# EAGLE schematic 16REG_2a (EAGLE 6.5.0)

## Sheet 1 of 19
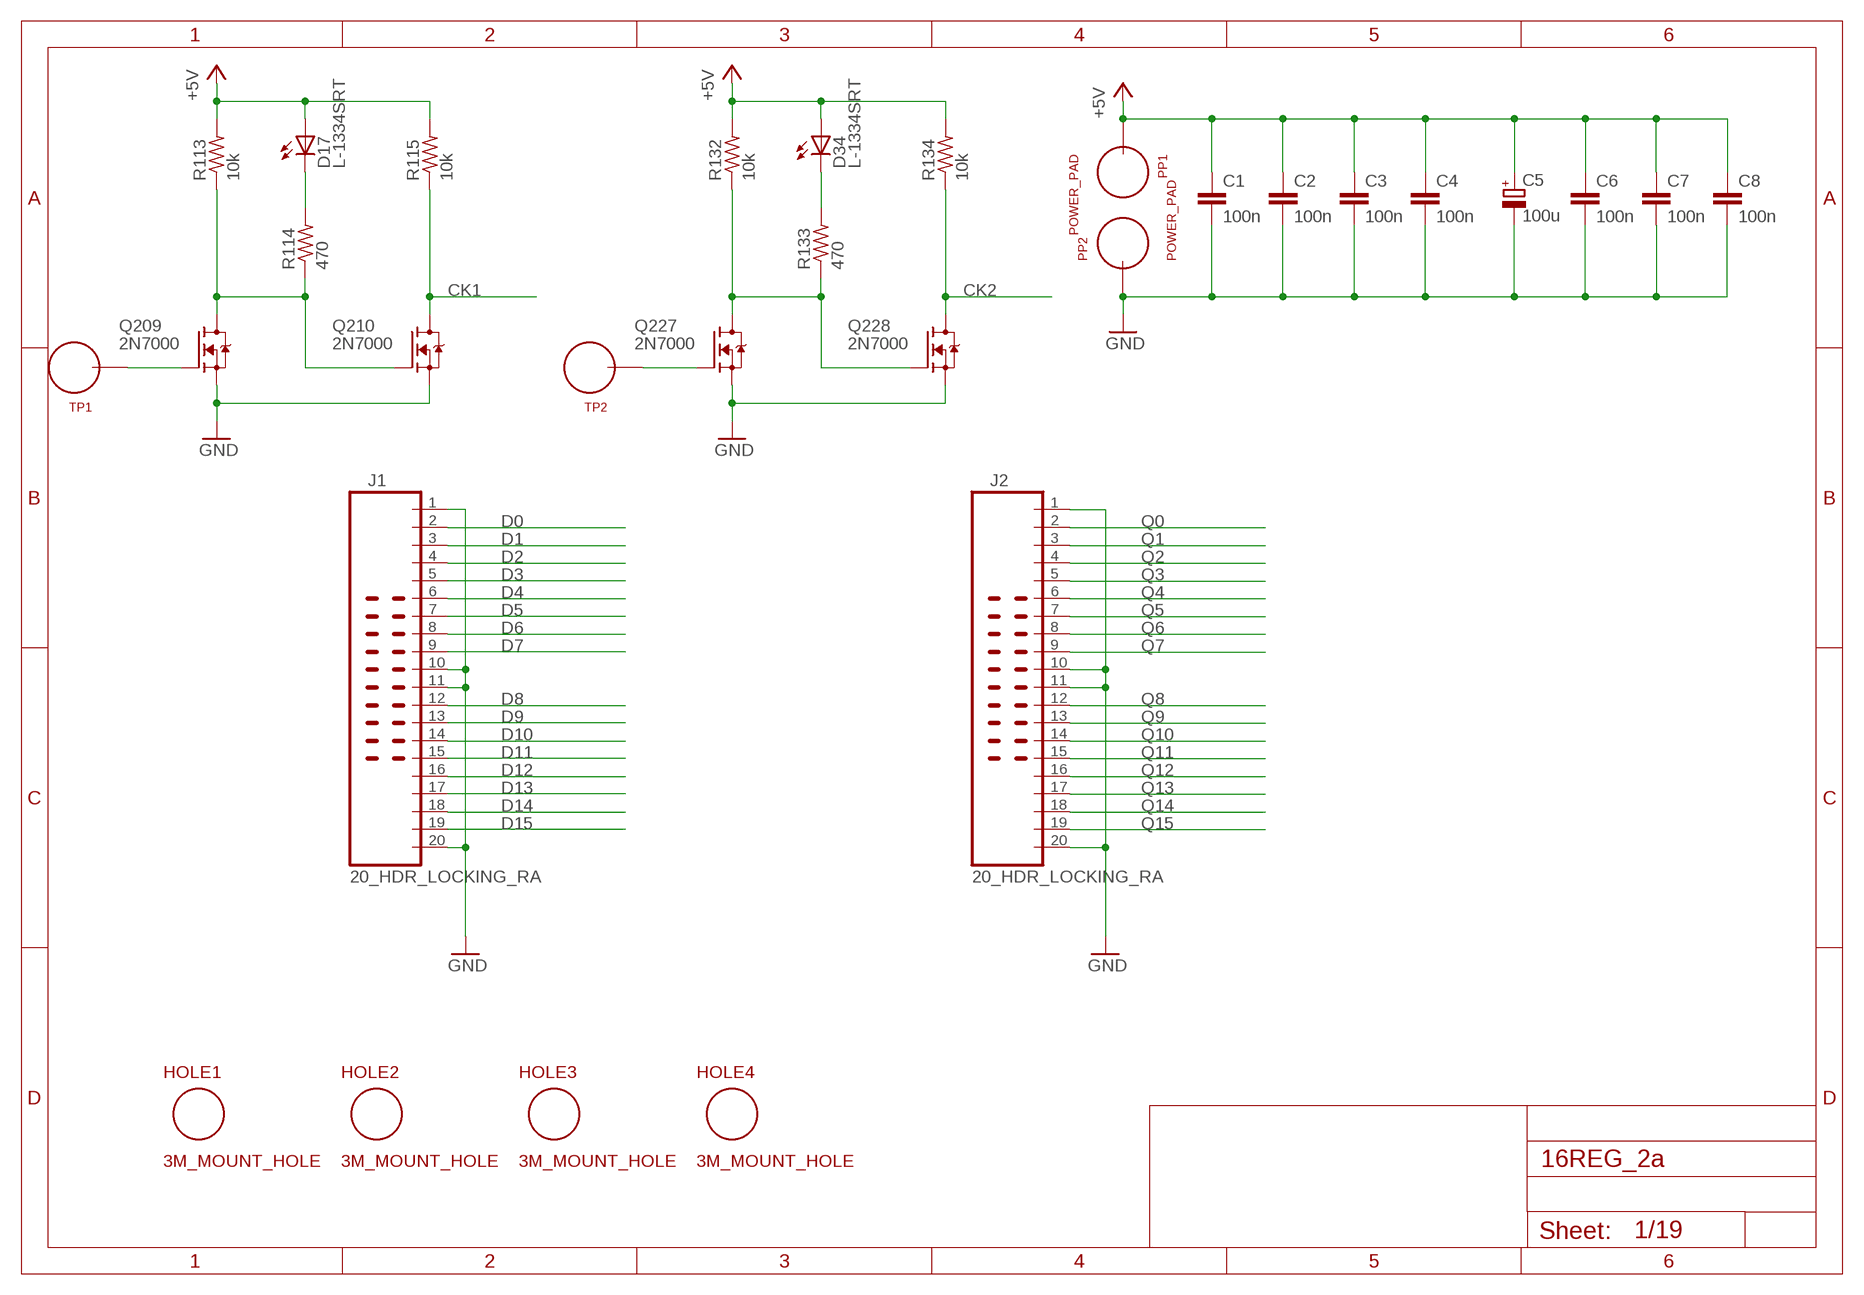
[diagram p0: schematic, sheet 1]

### Parts
C1  100n  C_P2INCH  [CAP_P2INCH]
C2  100n  C_P2INCH  [CAP_P2INCH]
C3  100n  C_P2INCH  [CAP_P2INCH]
C4  100n  C_P2INCH  [CAP_P2INCH]
C5  100u  POLARISED_CAP_2P5  [POLARISED_CAP_2P5]
C6  100n  C_P2INCH  [CAP_P2INCH]
C7  100n  C_P2INCH  [CAP_P2INCH]
C8  100n  C_P2INCH  [CAP_P2INCH]
D17  L-1334SRT  [LED3MM]
D34  L-1334SRT  [LED3MM]
HOLE1  3M_MOUNT_HOLE  [3M_HOLE]
HOLE2  3M_MOUNT_HOLE  [3M_HOLE]
HOLE3  3M_MOUNT_HOLE  [3M_HOLE]
HOLE4  3M_MOUNT_HOLE  [3M_HOLE]
J1  20_HDR_LOCKING_RA  [20_HDR_LOCKING_RA]
J2  20_HDR_LOCKING_RA  [20_HDR_LOCKING_RA]
PP1  POWER_PAD  [POWER_PAD]
PP2  POWER_PAD  [POWER_PAD]
Q209  2N7000  [TO92-DGS]
Q210  2N7000  [TO92-DGS]
Q227  2N7000  [TO92-DGS]
Q228  2N7000  [TO92-DGS]
R113  10k  R_P2INCH  [R_P2INCH]
R114  470  R_P2INCH  [R_P2INCH]
R115  10k  R_P2INCH  [R_P2INCH]
R132  10k  R_P2INCH  [R_P2INCH]
R133  470  R_P2INCH  [R_P2INCH]
R134  10k  R_P2INCH  [R_P2INCH]
TP1  TEST_LOOP  [TEST_LOOP]
TP2  TEST_LOOP  [TEST_LOOP]

### Nets
+5V: C1.1 C2.1 C3.1 C4.1 C5.A C6.1 C7.1 C8.1 D17.A D34.A PP1.1 R113.2 R115.2 R132.2 R134.2 ; also sheet 3,4,5,6,7,8,9,10,11,12,13,14,15,16,17,18,19
CK1: Q210.D R115.1 ; also sheet 4,5,6,7,8,9,10,11,12,13,14,15,16,17,18,19
CK2: Q228.D R134.1 ; also sheet 4,5,6,7,8,9,10,11,12,13,14,15,16,17,18,19
D0: J1.2 ; also sheet 3,4
D1: J1.3 ; also sheet 3,5
D2: J1.4 ; also sheet 3,6
D3: J1.5 ; also sheet 3,7
D4: J1.6 ; also sheet 3,8
D5: J1.7 ; also sheet 3,9
D6: J1.8 ; also sheet 3,10
D7: J1.9 ; also sheet 3,11
D8: J1.12 ; also sheet 3,12
D9: J1.13 ; also sheet 3,13
D10: J1.14 ; also sheet 3,14
D11: J1.15 ; also sheet 3,15
D12: J1.16 ; also sheet 3,16
D13: J1.17 ; also sheet 3,17
D14: J1.18 ; also sheet 3,18
D15: J1.19 ; also sheet 3,19
GND: C1.2 C2.2 C3.2 C4.2 C5.K C6.2 C7.2 C8.2 J1.1 J1.10 J1.11 J1.20 J2.1 J2.10 J2.11 J2.20 PP2.1 Q209.S Q210.S Q227.S Q228.S ; also sheet 2,3,4,5,6,7,8,9,10,11,12,13,14,15,16,17,18,19
N$1: Q227.G TP2.P$1
N$2: Q227.D Q228.G R132.1 R133.1
N$3: D34.K(C) R133.2
N$8: D17.K(C) R114.2
N$201: Q209.G TP1.P$1
N$202: Q209.D Q210.G R113.1 R114.1
Q0: J2.2 ; also sheet 2,4
Q1: J2.3 ; also sheet 2,5
Q2: J2.4 ; also sheet 2,6
Q3: J2.5 ; also sheet 2,7
Q4: J2.6 ; also sheet 2,8
Q5: J2.7 ; also sheet 2,9
Q6: J2.8 ; also sheet 2,10
Q7: J2.9 ; also sheet 2,11
Q8: J2.12 ; also sheet 2,12
Q9: J2.13 ; also sheet 2,13
Q10: J2.14 ; also sheet 2,14
Q11: J2.15 ; also sheet 2,15
Q12: J2.16 ; also sheet 2,16
Q13: J2.17 ; also sheet 2,17
Q14: J2.18 ; also sheet 2,18
Q15: J2.19 ; also sheet 2,19

## Sheet 2 of 19
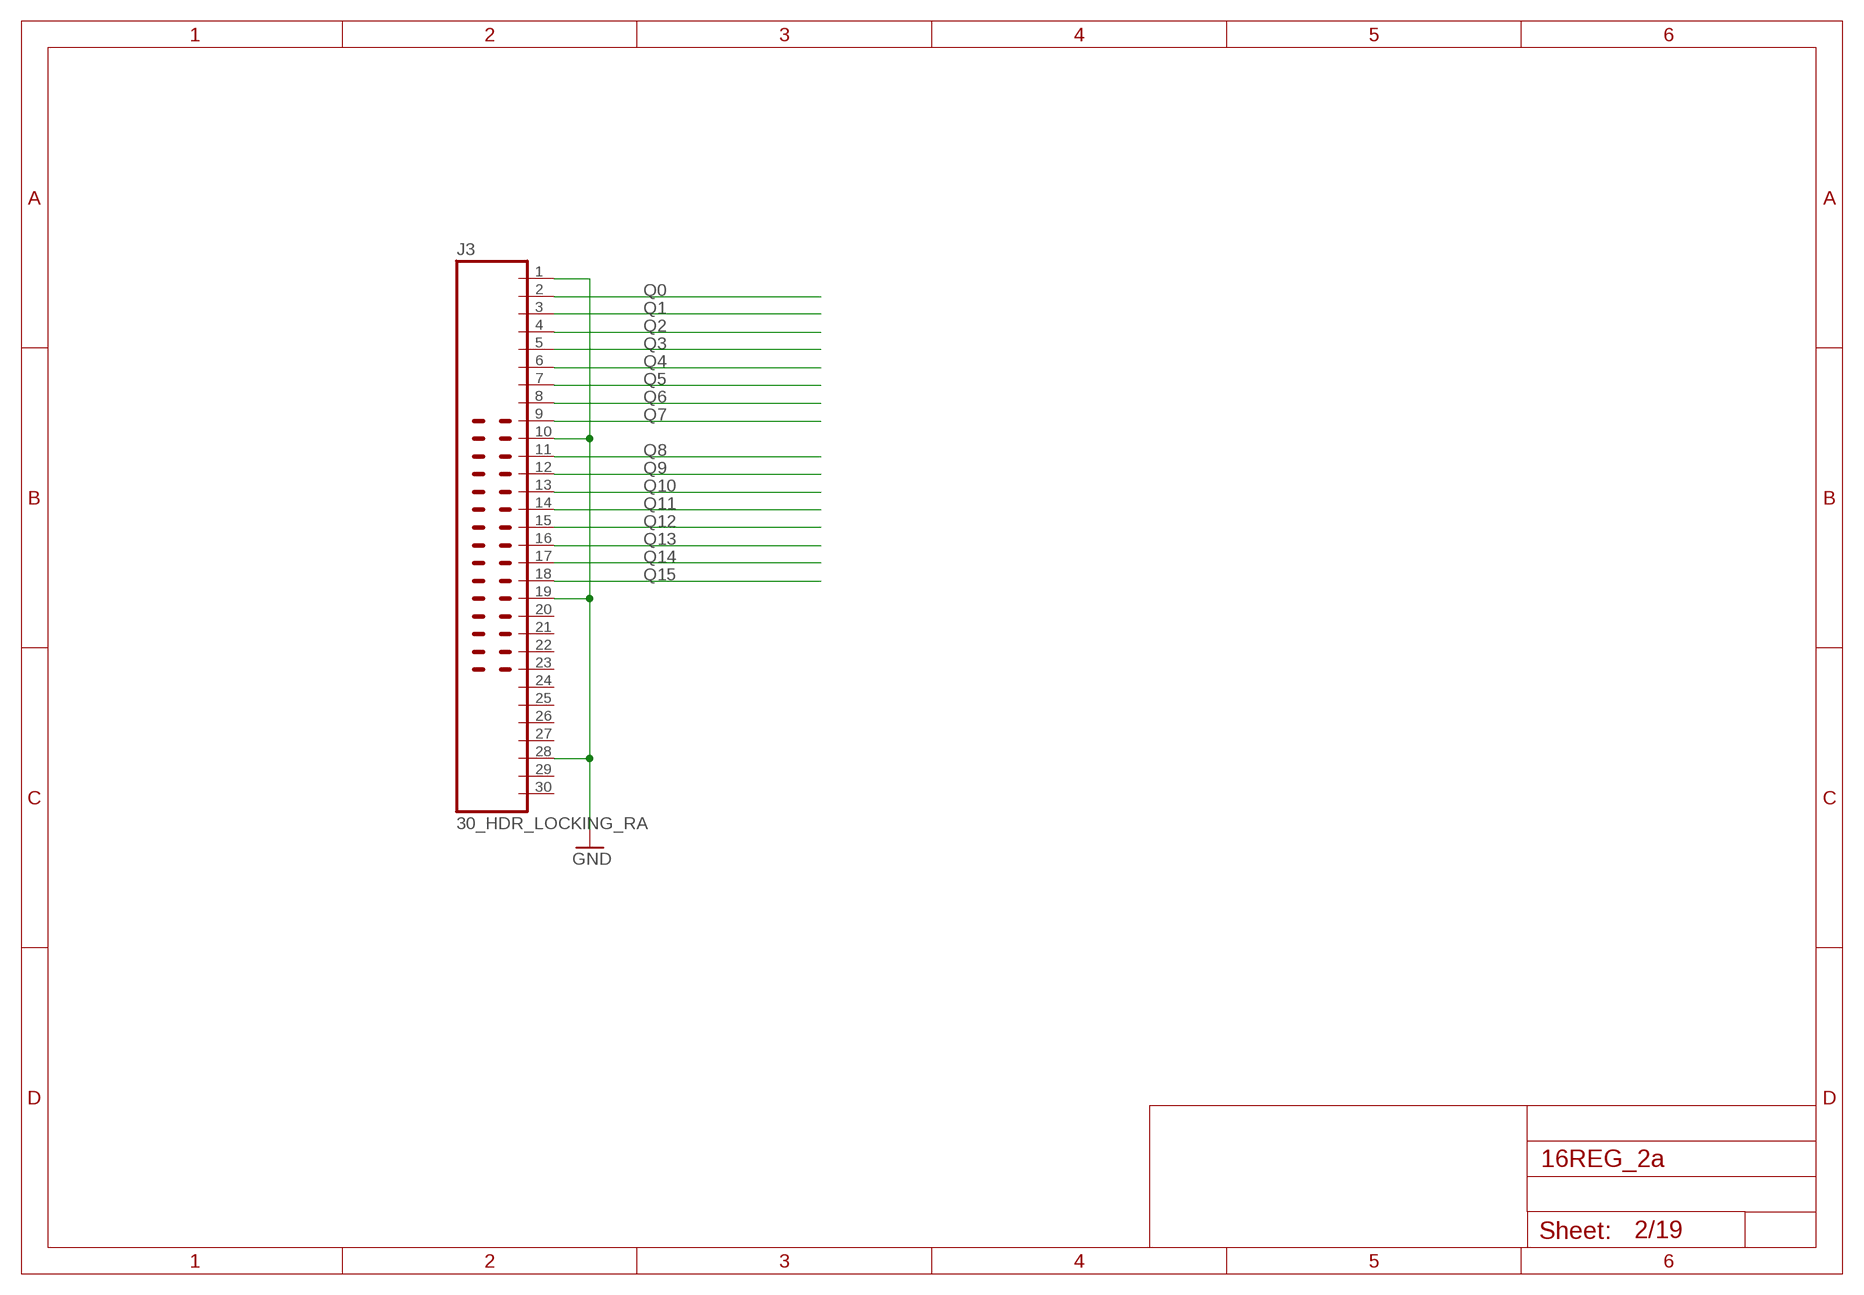
[diagram p1: schematic, sheet 2]

### Parts
J3  30_HDR_LOCKING_RA  [30_HDR_LOCKING_RA]

### Nets
GND: J3.1 J3.10 J3.19 J3.28 ; also sheet 1,3,4,5,6,7,8,9,10,11,12,13,14,15,16,17,18,19
Q0: J3.2 ; also sheet 1,4
Q1: J3.3 ; also sheet 1,5
Q2: J3.4 ; also sheet 1,6
Q3: J3.5 ; also sheet 1,7
Q4: J3.6 ; also sheet 1,8
Q5: J3.7 ; also sheet 1,9
Q6: J3.8 ; also sheet 1,10
Q7: J3.9 ; also sheet 1,11
Q8: J3.11 ; also sheet 1,12
Q9: J3.12 ; also sheet 1,13
Q10: J3.13 ; also sheet 1,14
Q11: J3.14 ; also sheet 1,15
Q12: J3.15 ; also sheet 1,16
Q13: J3.16 ; also sheet 1,17
Q14: J3.17 ; also sheet 1,18
Q15: J3.18 ; also sheet 1,19
Unconnected: J3.20 J3.21 J3.22 J3.23 J3.24 J3.25 J3.26 J3.27 J3.29 J3.30

## Sheet 3 of 19
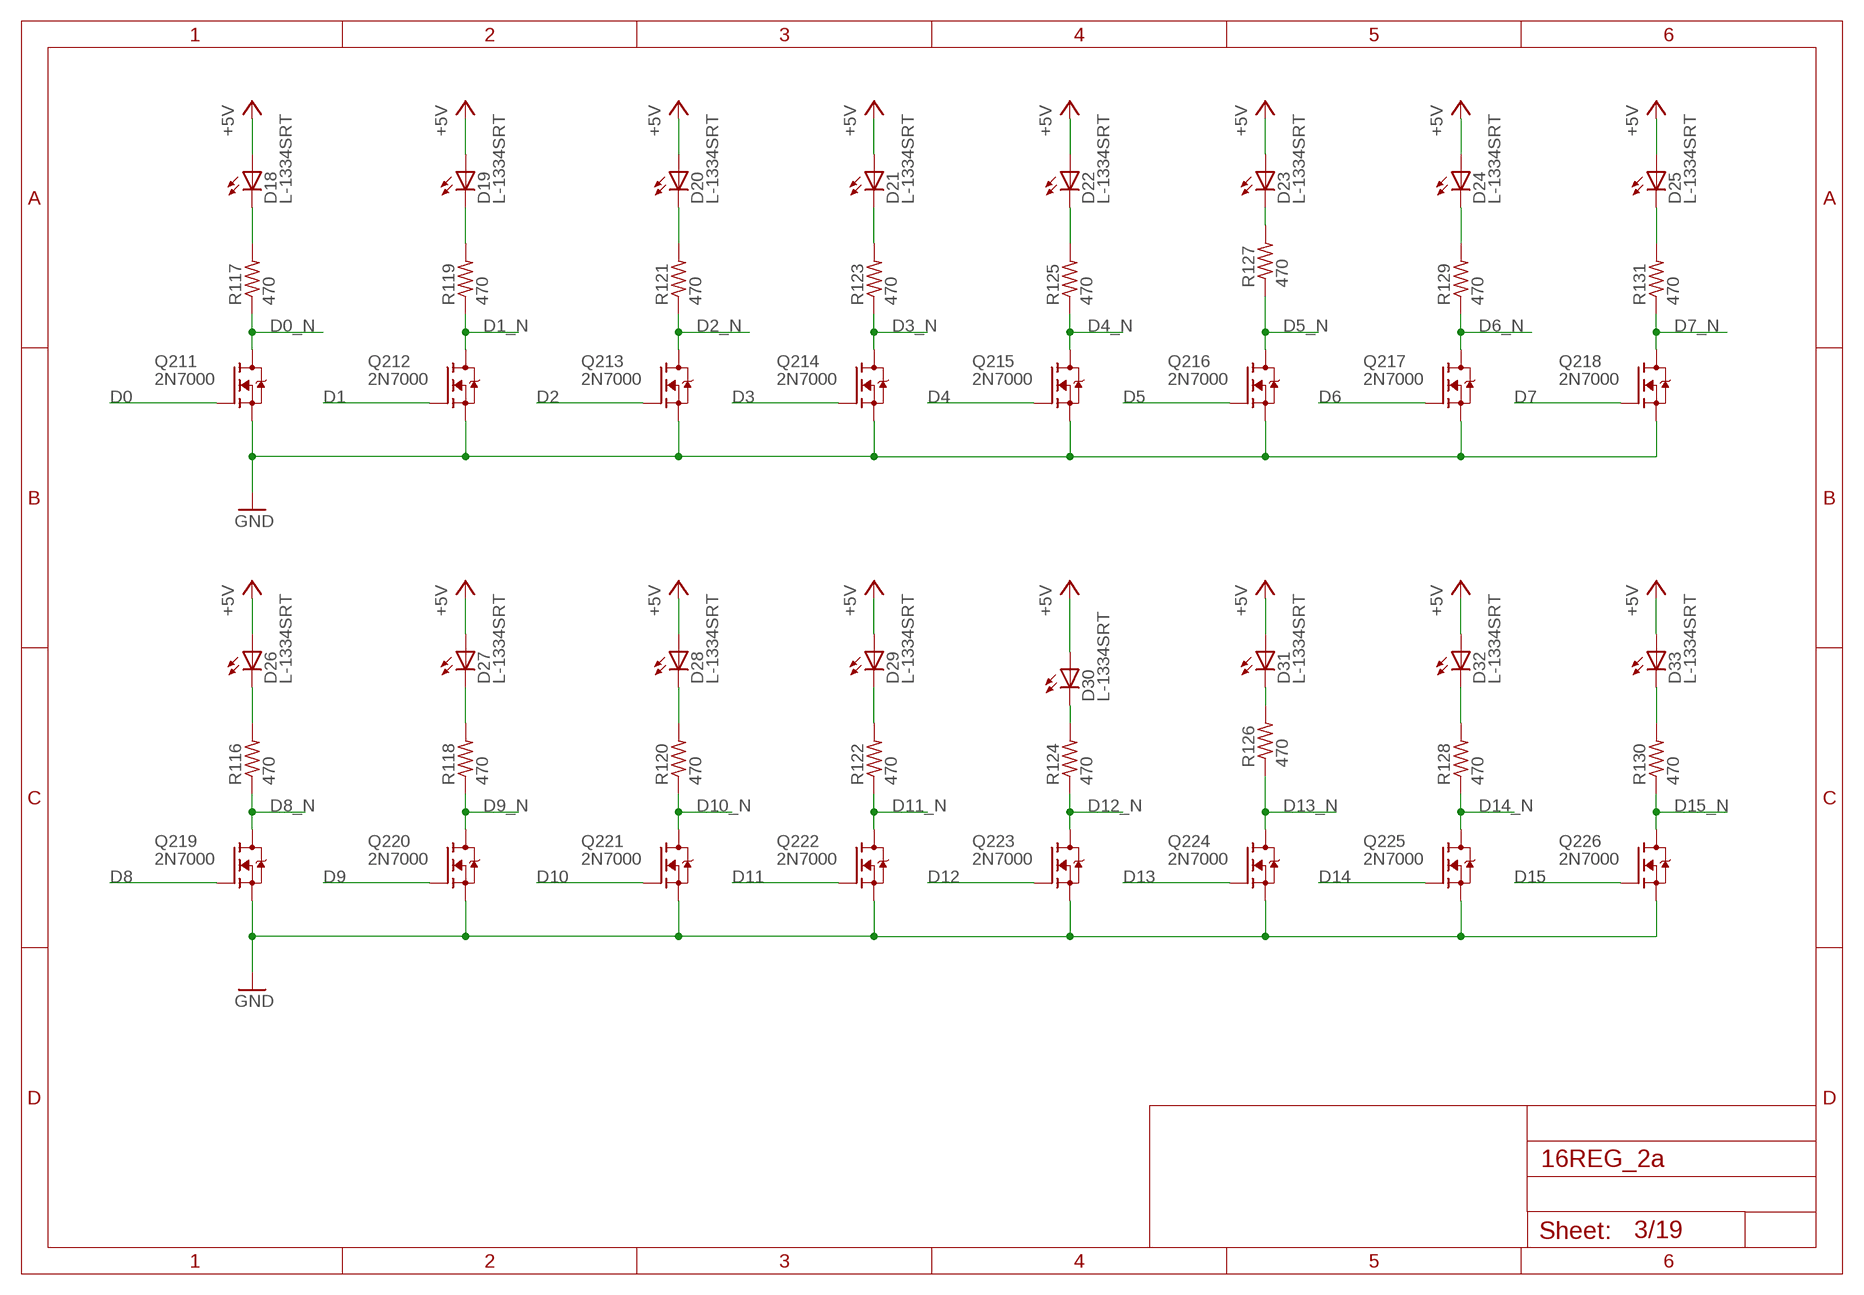
[diagram p2: schematic, sheet 3]

### Parts
D18  L-1334SRT  [LED3MM]
D19  L-1334SRT  [LED3MM]
D20  L-1334SRT  [LED3MM]
D21  L-1334SRT  [LED3MM]
D22  L-1334SRT  [LED3MM]
D23  L-1334SRT  [LED3MM]
D24  L-1334SRT  [LED3MM]
D25  L-1334SRT  [LED3MM]
D26  L-1334SRT  [LED3MM]
D27  L-1334SRT  [LED3MM]
D28  L-1334SRT  [LED3MM]
D29  L-1334SRT  [LED3MM]
D30  L-1334SRT  [LED3MM]
D31  L-1334SRT  [LED3MM]
D32  L-1334SRT  [LED3MM]
D33  L-1334SRT  [LED3MM]
Q211  2N7000  [TO92-DGS]
Q212  2N7000  [TO92-DGS]
Q213  2N7000  [TO92-DGS]
Q214  2N7000  [TO92-DGS]
Q215  2N7000  [TO92-DGS]
Q216  2N7000  [TO92-DGS]
Q217  2N7000  [TO92-DGS]
Q218  2N7000  [TO92-DGS]
Q219  2N7000  [TO92-DGS]
Q220  2N7000  [TO92-DGS]
Q221  2N7000  [TO92-DGS]
Q222  2N7000  [TO92-DGS]
Q223  2N7000  [TO92-DGS]
Q224  2N7000  [TO92-DGS]
Q225  2N7000  [TO92-DGS]
Q226  2N7000  [TO92-DGS]
R116  470  R_P2INCH  [R_P2INCH]
R117  470  R_P2INCH  [R_P2INCH]
R118  470  R_P2INCH  [R_P2INCH]
R119  470  R_P2INCH  [R_P2INCH]
R120  470  R_P2INCH  [R_P2INCH]
R121  470  R_P2INCH  [R_P2INCH]
R122  470  R_P2INCH  [R_P2INCH]
R123  470  R_P2INCH  [R_P2INCH]
R124  470  R_P2INCH  [R_P2INCH]
R125  470  R_P2INCH  [R_P2INCH]
R126  470  R_P2INCH  [R_P2INCH]
R127  470  R_P2INCH  [R_P2INCH]
R128  470  R_P2INCH  [R_P2INCH]
R129  470  R_P2INCH  [R_P2INCH]
R130  470  R_P2INCH  [R_P2INCH]
R131  470  R_P2INCH  [R_P2INCH]

### Nets
+5V: D18.A D19.A D20.A D21.A D22.A D23.A D24.A D25.A D26.A D27.A D28.A D29.A D30.A D31.A D32.A D33.A ; also sheet 1,4,5,6,7,8,9,10,11,12,13,14,15,16,17,18,19
D0: Q211.G ; also sheet 1,4
D0_N: Q211.D R117.1
D1: Q212.G ; also sheet 1,5
D1_N: Q212.D R119.1
D2: Q213.G ; also sheet 1,6
D2_N: Q213.D R121.1
D3: Q214.G ; also sheet 1,7
D3_N: Q214.D R123.1
D4: Q215.G ; also sheet 1,8
D4_N: Q215.D R125.1
D5: Q216.G ; also sheet 1,9
D5_N: Q216.D R127.1
D6: Q217.G ; also sheet 1,10
D6_N: Q217.D R129.1
D7: Q218.G ; also sheet 1,11
D7_N: Q218.D R131.1
D8: Q219.G ; also sheet 1,12
D8_N: Q219.D R116.1
D9: Q220.G ; also sheet 1,13
D9_N: Q220.D R118.1
D10: Q221.G ; also sheet 1,14
D10_N: Q221.D R120.1
D11: Q222.G ; also sheet 1,15
D11_N: Q222.D R122.1
D12: Q223.G ; also sheet 1,16
D12_N: Q223.D R124.1
D13: Q224.G ; also sheet 1,17
D13_N: Q224.D R126.1
D14: Q225.G ; also sheet 1,18
D14_N: Q225.D R128.1
D15: Q226.G ; also sheet 1,19
D15_N: Q226.D R130.1
GND: Q211.S Q212.S Q213.S Q214.S Q215.S Q216.S Q217.S Q218.S Q219.S Q220.S Q221.S Q222.S Q223.S Q224.S Q225.S Q226.S ; also sheet 1,2,4,5,6,7,8,9,10,11,12,13,14,15,16,17,18,19
N$203: D18.K(C) R117.2
N$205: D19.K(C) R119.2
N$207: D20.K(C) R121.2
N$209: D21.K(C) R123.2
N$211: D22.K(C) R125.2
N$213: D23.K(C) R127.2
N$215: D24.K(C) R129.2
N$217: D25.K(C) R131.2
N$219: D33.K(C) R130.2
N$221: D32.K(C) R128.2
N$223: D31.K(C) R126.2
N$225: D30.K(C) R124.2
N$227: D29.K(C) R122.2
N$229: D28.K(C) R120.2
N$231: D27.K(C) R118.2
N$233: D26.K(C) R116.2

## Sheet 4 of 19
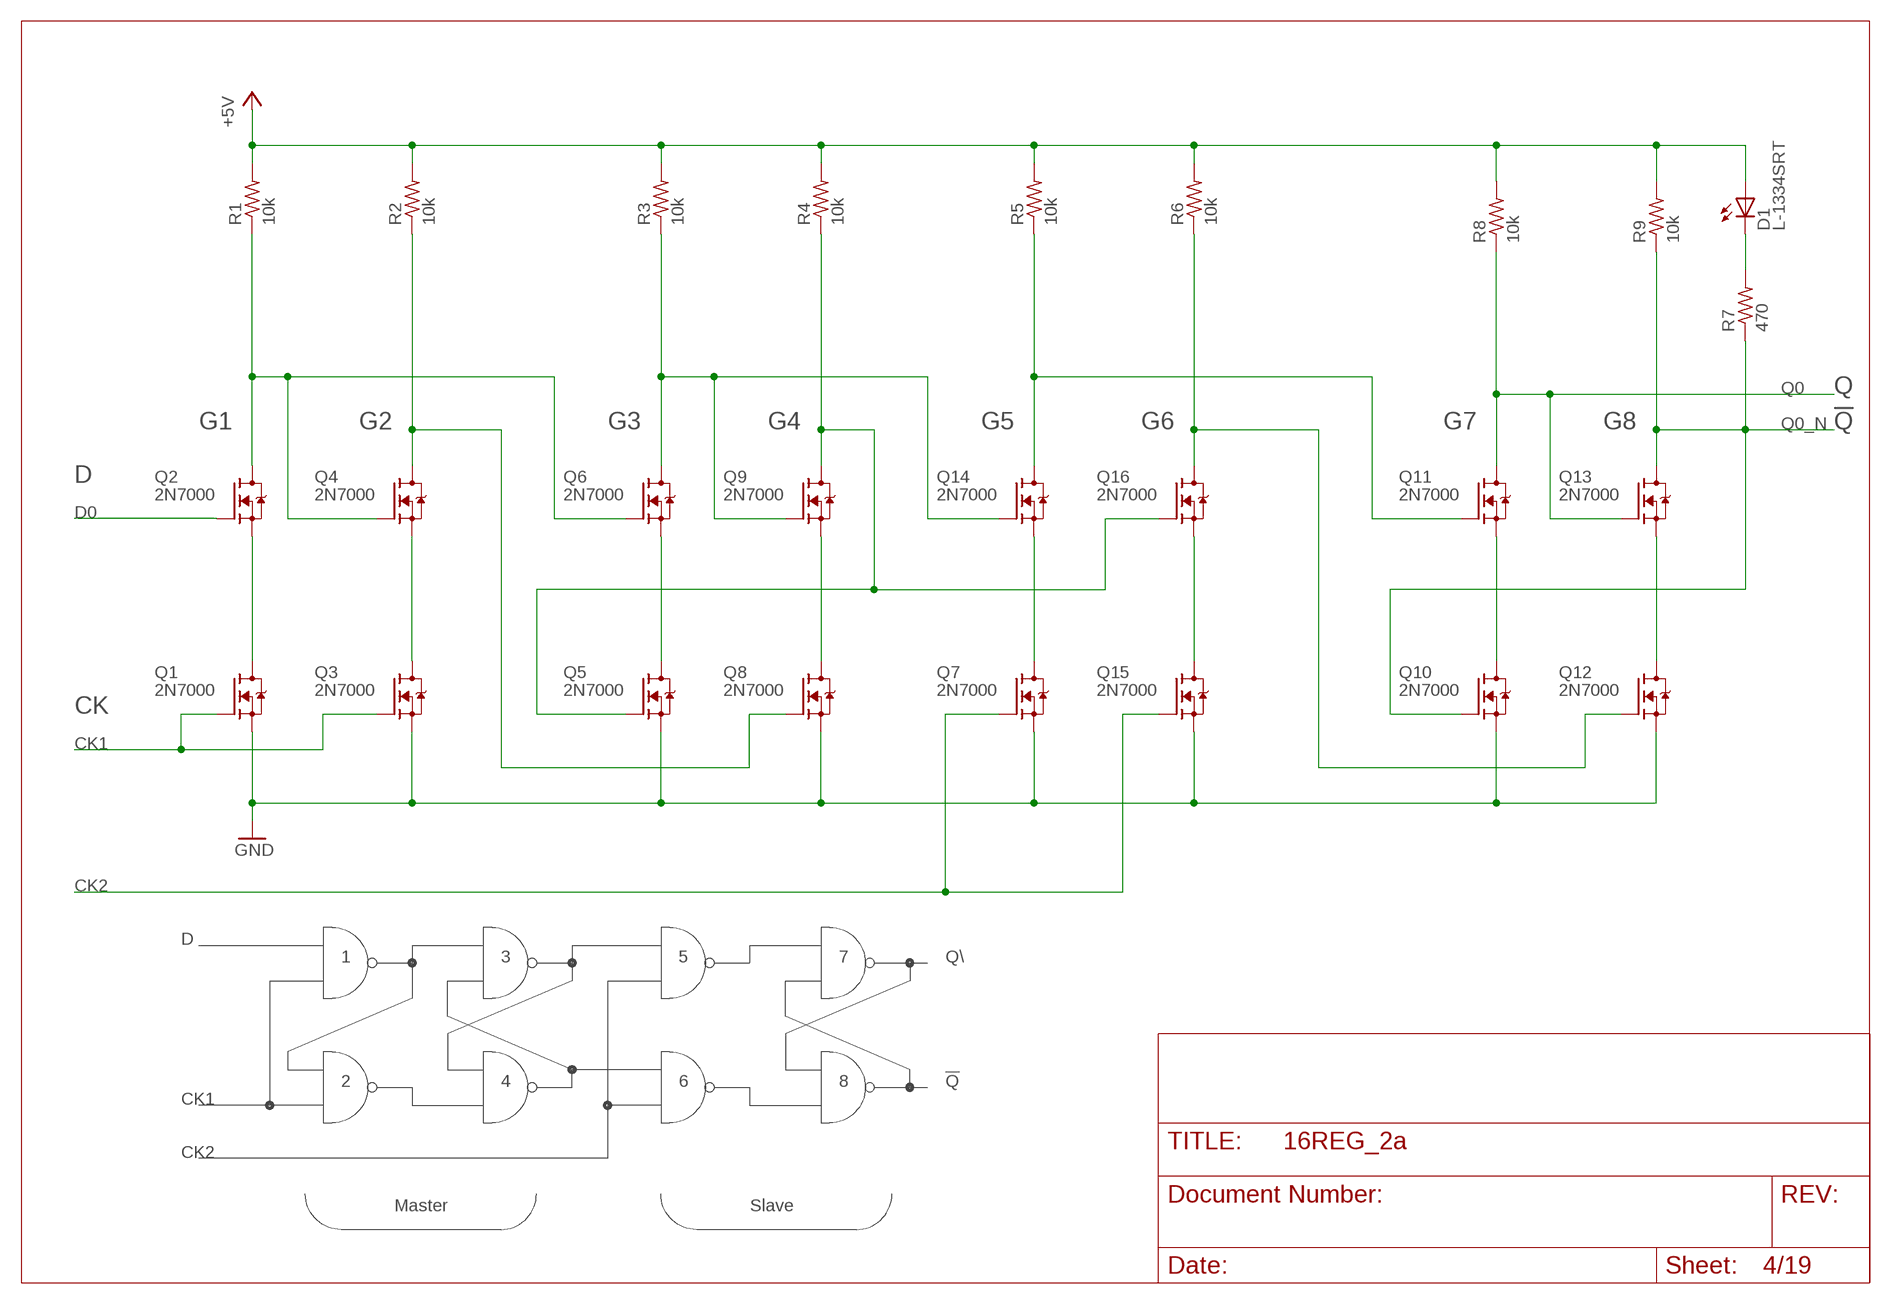
[diagram p3: schematic, sheet 4]

### Parts
D1  L-1334SRT  [LED3MM]
Q1  2N7000  [TO92-DGS]
Q2  2N7000  [TO92-DGS]
Q3  2N7000  [TO92-DGS]
Q4  2N7000  [TO92-DGS]
Q5  2N7000  [TO92-DGS]
Q6  2N7000  [TO92-DGS]
Q7  2N7000  [TO92-DGS]
Q8  2N7000  [TO92-DGS]
Q9  2N7000  [TO92-DGS]
Q10  2N7000  [TO92-DGS]
Q11  2N7000  [TO92-DGS]
Q12  2N7000  [TO92-DGS]
Q13  2N7000  [TO92-DGS]
Q14  2N7000  [TO92-DGS]
Q15  2N7000  [TO92-DGS]
Q16  2N7000  [TO92-DGS]
R1  10k  R_P2INCH  [R_P2INCH]
R2  10k  R_P2INCH  [R_P2INCH]
R3  10k  R_P2INCH  [R_P2INCH]
R4  10k  R_P2INCH  [R_P2INCH]
R5  10k  R_P2INCH  [R_P2INCH]
R6  10k  R_P2INCH  [R_P2INCH]
R7  470  R_P2INCH  [R_P2INCH]
R8  10k  R_P2INCH  [R_P2INCH]
R9  10k  R_P2INCH  [R_P2INCH]

### Nets
+5V: D1.A R1.2 R2.2 R3.2 R4.2 R5.2 R6.2 R8.2 R9.2 ; also sheet 1,3,5,6,7,8,9,10,11,12,13,14,15,16,17,18,19
CK1: Q1.G Q3.G ; also sheet 1,5,6,7,8,9,10,11,12,13,14,15,16,17,18,19
CK2: Q7.G Q15.G ; also sheet 1,5,6,7,8,9,10,11,12,13,14,15,16,17,18,19
D0: Q2.G ; also sheet 1,3
GND: Q1.S Q3.S Q5.S Q7.S Q8.S Q10.S Q12.S Q15.S ; also sheet 1,2,3,5,6,7,8,9,10,11,12,13,14,15,16,17,18,19
N$4: Q7.D Q14.S
N$5: Q6.D Q9.G Q14.G R3.1
N$6: Q15.D Q16.S
N$7: Q4.D Q8.G R2.1
N$9: Q1.D Q2.S
N$10: Q3.D Q4.S
N$11: Q11.G Q14.D R5.1
N$12: Q5.D Q6.S
N$13: Q8.D Q9.S
N$14: Q10.D Q11.S
N$15: Q12.D Q13.S
N$16: Q2.D Q4.G Q6.G R1.1
N$19: Q5.G Q9.D Q16.G R4.1
N$22: Q12.G Q16.D R6.1
N$25: D1.K(C) R7.2
Q0: Q11.D Q13.G R8.1 ; also sheet 1,2
Q0_N: Q10.G Q13.D R7.1 R9.1

### Notes on the sheet
- Q
- G1 | G2 | G3 | G4 | G5 | G6 | G7 | G8 | !Q
- D
- CK
- D
- 1 | 3 | 5 | 7 | Q\
- 2 | 4 | 6 | 8 | !Q
- CK1
- CK2
- Master | Slave

## Sheet 5 of 19
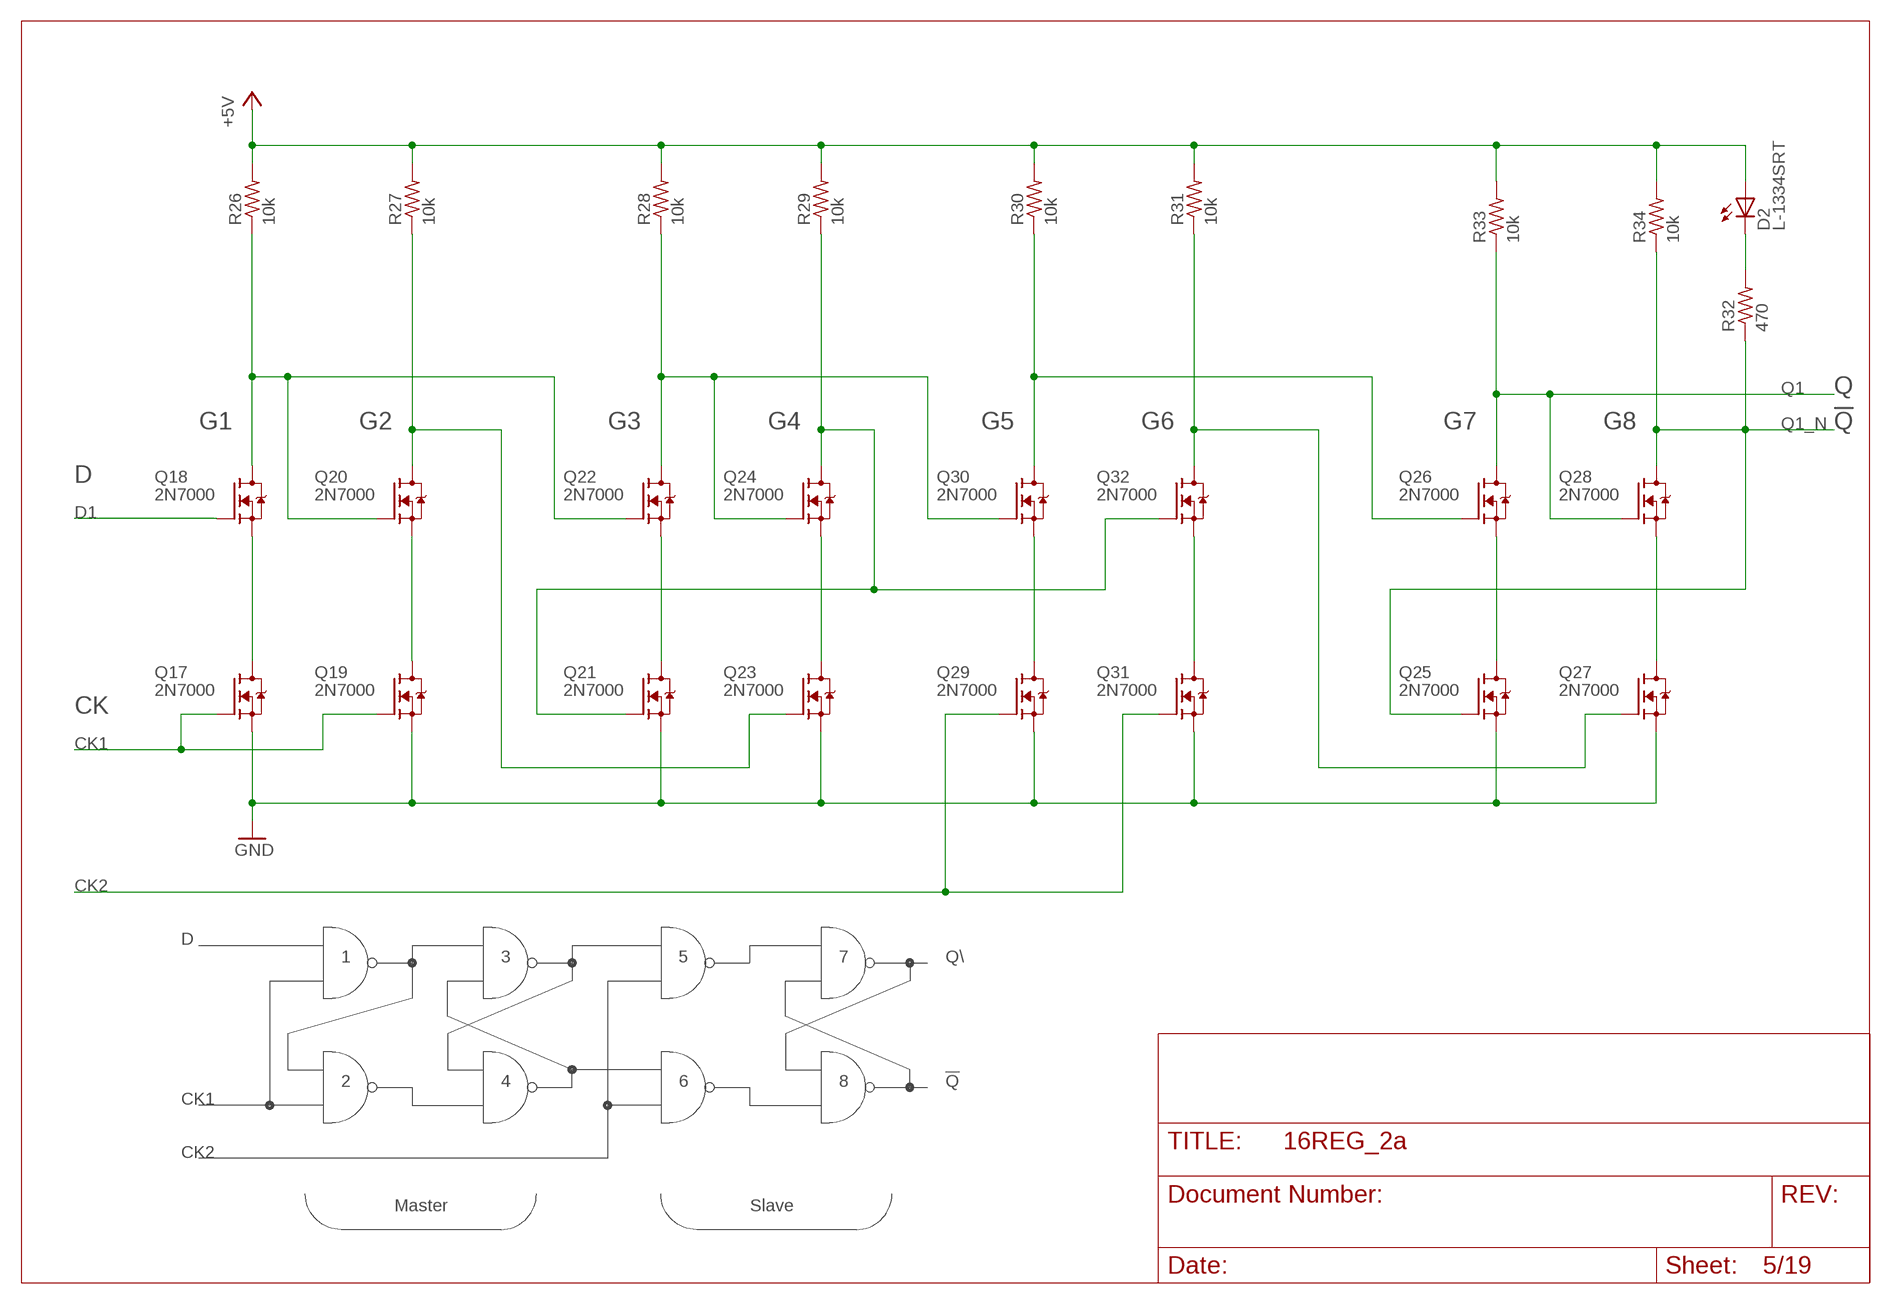
[diagram p4: schematic, sheet 5]

### Parts
D2  L-1334SRT  [LED3MM]
Q17  2N7000  [TO92-DGS]
Q18  2N7000  [TO92-DGS]
Q19  2N7000  [TO92-DGS]
Q20  2N7000  [TO92-DGS]
Q21  2N7000  [TO92-DGS]
Q22  2N7000  [TO92-DGS]
Q23  2N7000  [TO92-DGS]
Q24  2N7000  [TO92-DGS]
Q25  2N7000  [TO92-DGS]
Q26  2N7000  [TO92-DGS]
Q27  2N7000  [TO92-DGS]
Q28  2N7000  [TO92-DGS]
Q29  2N7000  [TO92-DGS]
Q30  2N7000  [TO92-DGS]
Q31  2N7000  [TO92-DGS]
Q32  2N7000  [TO92-DGS]
R26  10k  R_P2INCH  [R_P2INCH]
R27  10k  R_P2INCH  [R_P2INCH]
R28  10k  R_P2INCH  [R_P2INCH]
R29  10k  R_P2INCH  [R_P2INCH]
R30  10k  R_P2INCH  [R_P2INCH]
R31  10k  R_P2INCH  [R_P2INCH]
R32  470  R_P2INCH  [R_P2INCH]
R33  10k  R_P2INCH  [R_P2INCH]
R34  10k  R_P2INCH  [R_P2INCH]

### Nets
+5V: D2.A R26.2 R27.2 R28.2 R29.2 R30.2 R31.2 R33.2 R34.2 ; also sheet 1,3,4,6,7,8,9,10,11,12,13,14,15,16,17,18,19
CK1: Q17.G Q19.G ; also sheet 1,4,6,7,8,9,10,11,12,13,14,15,16,17,18,19
CK2: Q29.G Q31.G ; also sheet 1,4,6,7,8,9,10,11,12,13,14,15,16,17,18,19
D1: Q18.G ; also sheet 1,3
GND: Q17.S Q19.S Q21.S Q23.S Q25.S Q27.S Q29.S Q31.S ; also sheet 1,2,3,4,6,7,8,9,10,11,12,13,14,15,16,17,18,19
N$17: Q17.D Q18.S
N$18: Q19.D Q20.S
N$20: Q21.D Q22.S
N$21: Q23.D Q24.S
N$23: Q25.D Q26.S
N$24: Q27.D Q28.S
N$26: Q18.D Q20.G Q22.G R26.1
N$27: Q21.G Q24.D Q32.G R29.1
N$28: D2.K(C) R32.2
N$29: Q22.D Q24.G Q30.G R28.1
N$30: Q20.D Q23.G R27.1
N$31: Q29.D Q30.S
N$32: Q31.D Q32.S
N$33: Q26.G Q30.D R30.1
N$34: Q27.G Q32.D R31.1
Q1: Q26.D Q28.G R33.1 ; also sheet 1,2
Q1_N: Q25.G Q28.D R32.1 R34.1

### Notes on the sheet
- Q
- G1 | G2 | G3 | G4 | G5 | G6 | G7 | G8 | !Q
- D
- CK
- D
- 1 | 3 | 5 | 7 | Q\
- 2 | 4 | 6 | 8 | !Q
- CK1
- CK2
- Master | Slave

## Sheet 6 of 19
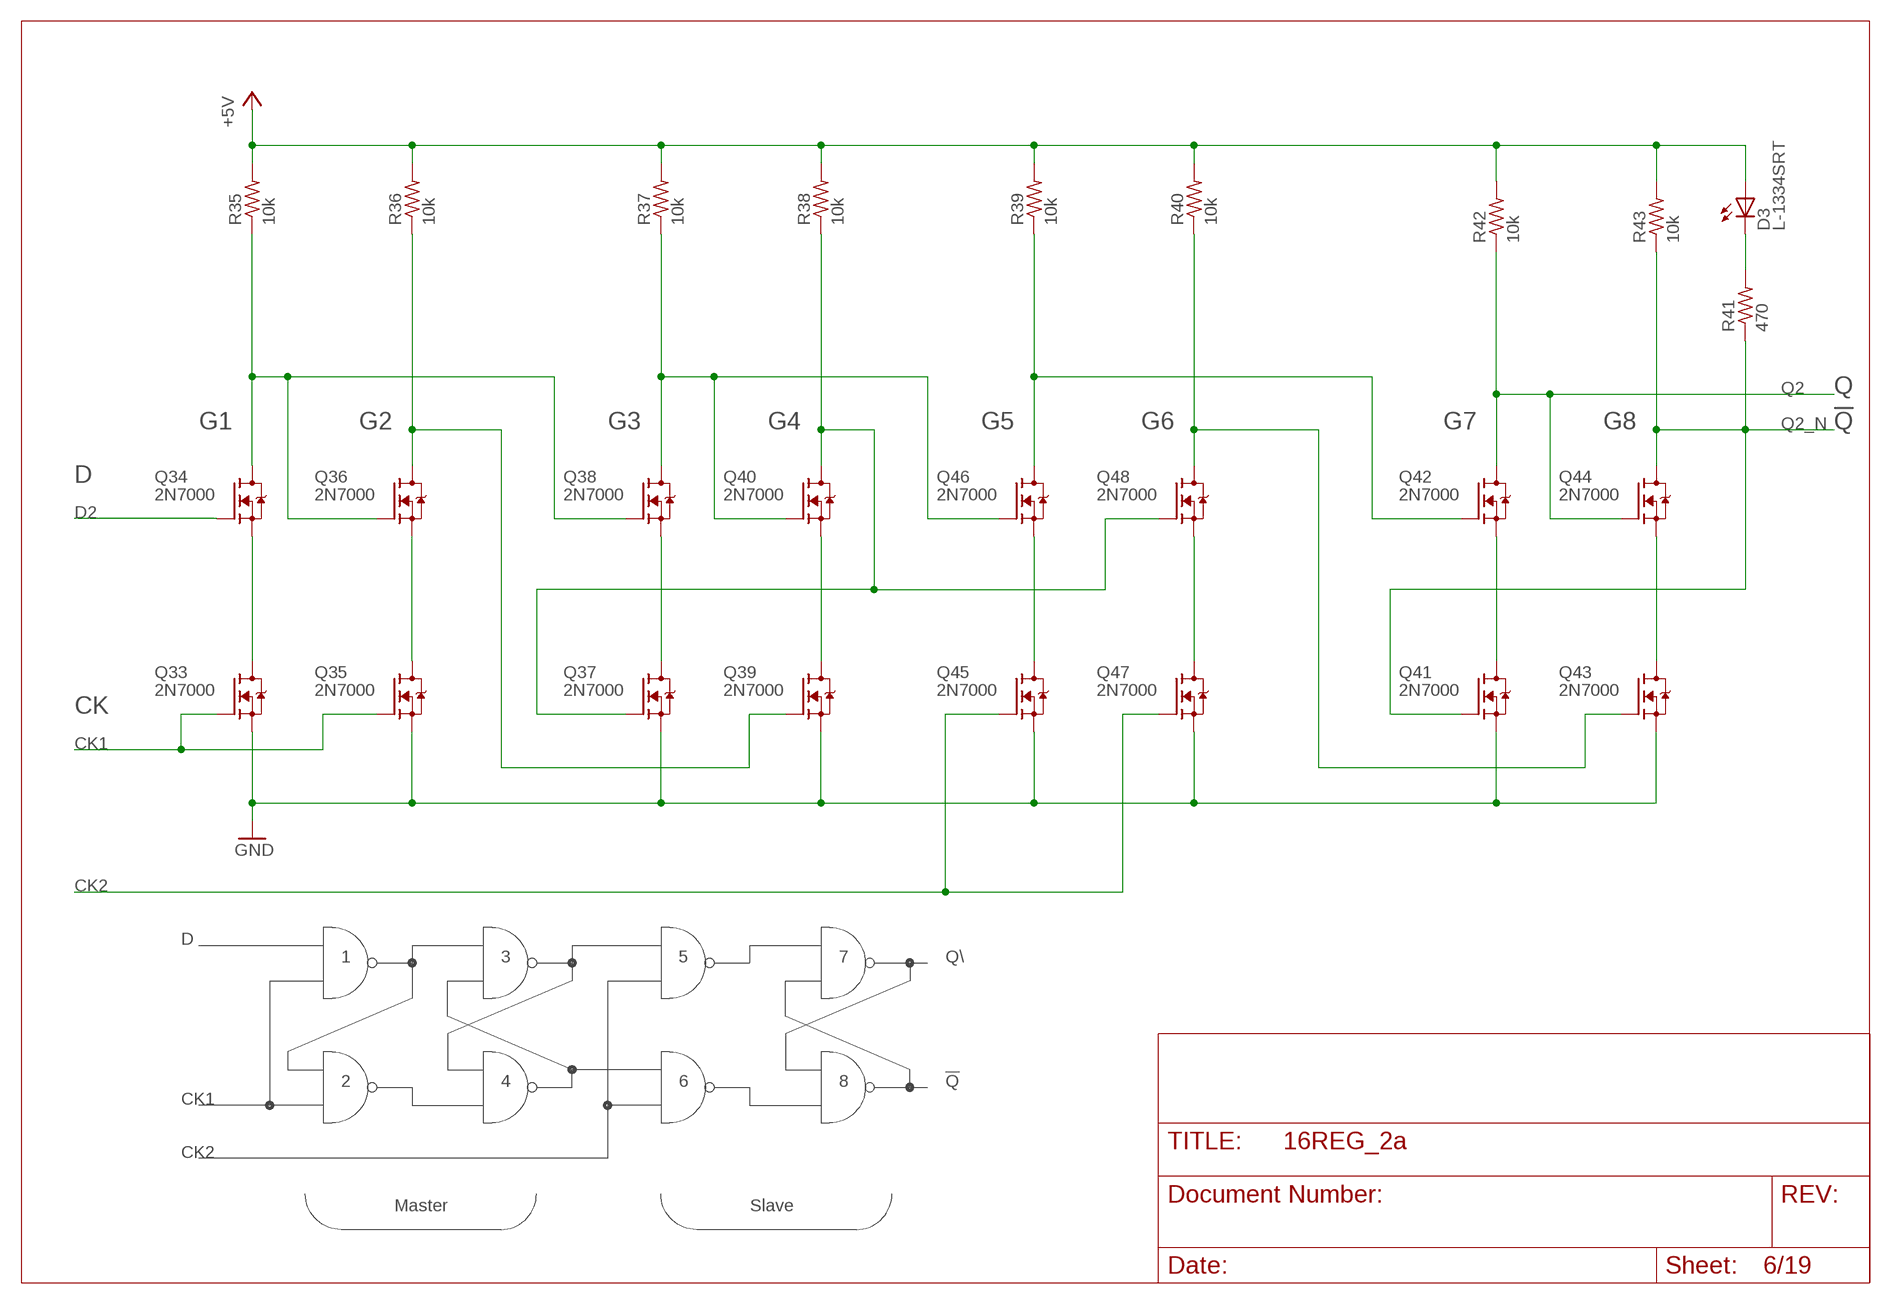
[diagram p5: schematic, sheet 6]

### Parts
D3  L-1334SRT  [LED3MM]
Q33  2N7000  [TO92-DGS]
Q34  2N7000  [TO92-DGS]
Q35  2N7000  [TO92-DGS]
Q36  2N7000  [TO92-DGS]
Q37  2N7000  [TO92-DGS]
Q38  2N7000  [TO92-DGS]
Q39  2N7000  [TO92-DGS]
Q40  2N7000  [TO92-DGS]
Q41  2N7000  [TO92-DGS]
Q42  2N7000  [TO92-DGS]
Q43  2N7000  [TO92-DGS]
Q44  2N7000  [TO92-DGS]
Q45  2N7000  [TO92-DGS]
Q46  2N7000  [TO92-DGS]
Q47  2N7000  [TO92-DGS]
Q48  2N7000  [TO92-DGS]
R35  10k  R_P2INCH  [R_P2INCH]
R36  10k  R_P2INCH  [R_P2INCH]
R37  10k  R_P2INCH  [R_P2INCH]
R38  10k  R_P2INCH  [R_P2INCH]
R39  10k  R_P2INCH  [R_P2INCH]
R40  10k  R_P2INCH  [R_P2INCH]
R41  470  R_P2INCH  [R_P2INCH]
R42  10k  R_P2INCH  [R_P2INCH]
R43  10k  R_P2INCH  [R_P2INCH]

### Nets
+5V: D3.A R35.2 R36.2 R37.2 R38.2 R39.2 R40.2 R42.2 R43.2 ; also sheet 1,3,4,5,7,8,9,10,11,12,13,14,15,16,17,18,19
CK1: Q33.G Q35.G ; also sheet 1,4,5,7,8,9,10,11,12,13,14,15,16,17,18,19
CK2: Q45.G Q47.G ; also sheet 1,4,5,7,8,9,10,11,12,13,14,15,16,17,18,19
D2: Q34.G ; also sheet 1,3
GND: Q33.S Q35.S Q37.S Q39.S Q41.S Q43.S Q45.S Q47.S ; also sheet 1,2,3,4,5,7,8,9,10,11,12,13,14,15,16,17,18,19
N$35: Q33.D Q34.S
N$36: Q35.D Q36.S
N$37: Q37.D Q38.S
N$38: Q39.D Q40.S
N$39: Q41.D Q42.S
N$40: Q43.D Q44.S
N$41: Q34.D Q36.G Q38.G R35.1
N$42: Q37.G Q40.D Q48.G R38.1
N$43: D3.K(C) R41.2
N$44: Q38.D Q40.G Q46.G R37.1
N$45: Q36.D Q39.G R36.1
N$46: Q45.D Q46.S
N$47: Q47.D Q48.S
N$48: Q42.G Q46.D R39.1
N$49: Q43.G Q48.D R40.1
Q2: Q42.D Q44.G R42.1 ; also sheet 1,2
Q2_N: Q41.G Q44.D R41.1 R43.1

### Notes on the sheet
- Q
- G1 | G2 | G3 | G4 | G5 | G6 | G7 | G8 | !Q
- D
- CK
- D
- 1 | 3 | 5 | 7 | Q\
- 2 | 4 | 6 | 8 | !Q
- CK1
- CK2
- Master | Slave

## Sheet 7 of 19
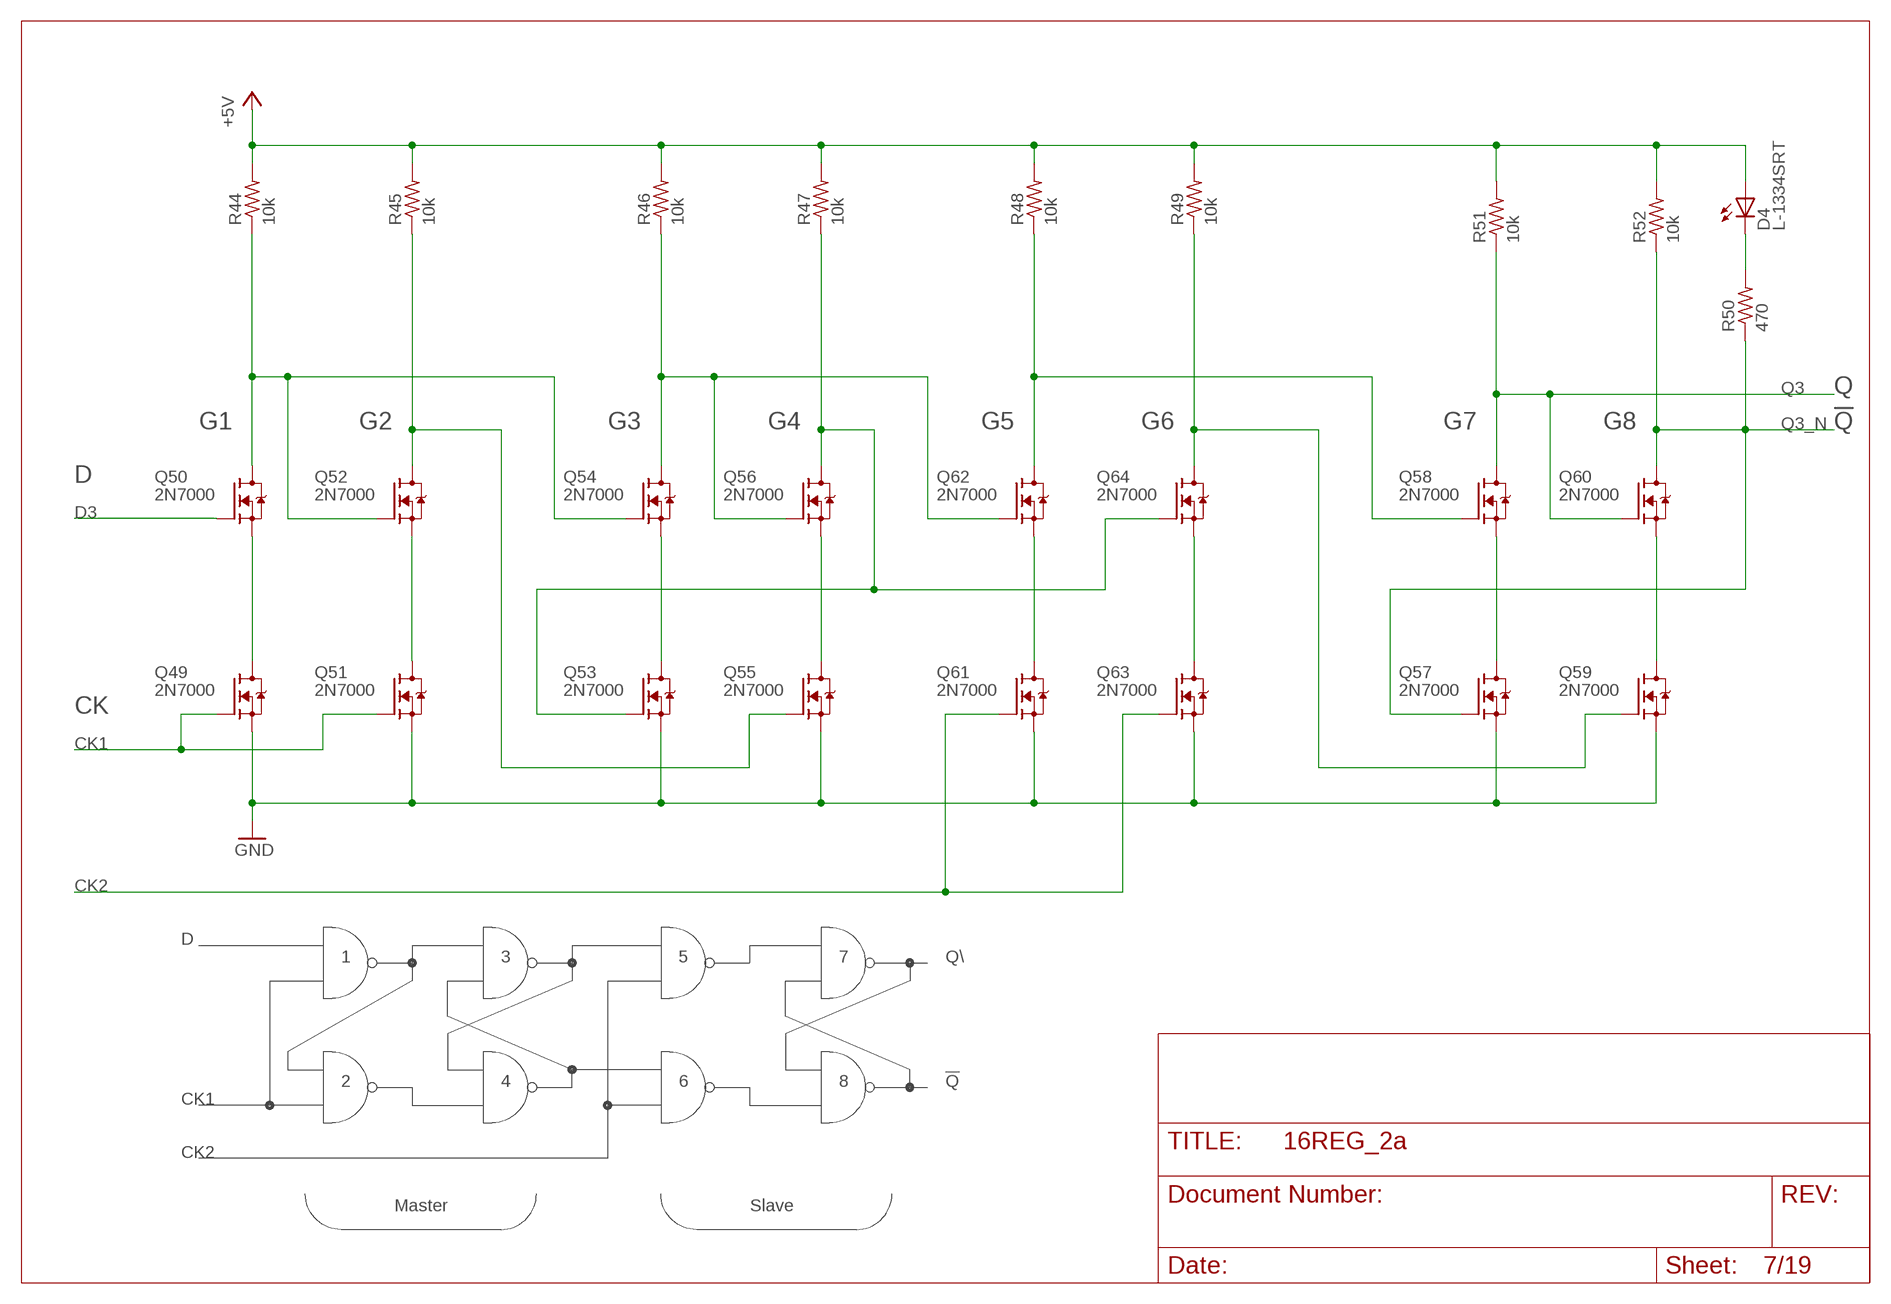
[diagram p6: schematic, sheet 7]

### Parts
D4  L-1334SRT  [LED3MM]
Q49  2N7000  [TO92-DGS]
Q50  2N7000  [TO92-DGS]
Q51  2N7000  [TO92-DGS]
Q52  2N7000  [TO92-DGS]
Q53  2N7000  [TO92-DGS]
Q54  2N7000  [TO92-DGS]
Q55  2N7000  [TO92-DGS]
Q56  2N7000  [TO92-DGS]
Q57  2N7000  [TO92-DGS]
Q58  2N7000  [TO92-DGS]
Q59  2N7000  [TO92-DGS]
Q60  2N7000  [TO92-DGS]
Q61  2N7000  [TO92-DGS]
Q62  2N7000  [TO92-DGS]
Q63  2N7000  [TO92-DGS]
Q64  2N7000  [TO92-DGS]
R44  10k  R_P2INCH  [R_P2INCH]
R45  10k  R_P2INCH  [R_P2INCH]
R46  10k  R_P2INCH  [R_P2INCH]
R47  10k  R_P2INCH  [R_P2INCH]
R48  10k  R_P2INCH  [R_P2INCH]
R49  10k  R_P2INCH  [R_P2INCH]
R50  470  R_P2INCH  [R_P2INCH]
R51  10k  R_P2INCH  [R_P2INCH]
R52  10k  R_P2INCH  [R_P2INCH]

### Nets
+5V: D4.A R44.2 R45.2 R46.2 R47.2 R48.2 R49.2 R51.2 R52.2 ; also sheet 1,3,4,5,6,8,9,10,11,12,13,14,15,16,17,18,19
CK1: Q49.G Q51.G ; also sheet 1,4,5,6,8,9,10,11,12,13,14,15,16,17,18,19
CK2: Q61.G Q63.G ; also sheet 1,4,5,6,8,9,10,11,12,13,14,15,16,17,18,19
D3: Q50.G ; also sheet 1,3
GND: Q49.S Q51.S Q53.S Q55.S Q57.S Q59.S Q61.S Q63.S ; also sheet 1,2,3,4,5,6,8,9,10,11,12,13,14,15,16,17,18,19
N$50: Q49.D Q50.S
N$51: Q51.D Q52.S
N$52: Q53.D Q54.S
N$53: Q55.D Q56.S
N$54: Q57.D Q58.S
N$55: Q59.D Q60.S
N$56: Q50.D Q52.G Q54.G R44.1
N$57: Q53.G Q56.D Q64.G R47.1
N$58: D4.K(C) R50.2
N$59: Q54.D Q56.G Q62.G R46.1
N$60: Q52.D Q55.G R45.1
N$61: Q61.D Q62.S
N$62: Q63.D Q64.S
N$63: Q58.G Q62.D R48.1
N$64: Q59.G Q64.D R49.1
Q3: Q58.D Q60.G R51.1 ; also sheet 1,2
Q3_N: Q57.G Q60.D R50.1 R52.1

### Notes on the sheet
- Q
- G1 | G2 | G3 | G4 | G5 | G6 | G7 | G8 | !Q
- D
- CK
- D
- 1 | 3 | 5 | 7 | Q\
- 2 | 4 | 6 | 8 | !Q
- CK1
- CK2
- Master | Slave

## Sheet 8 of 19
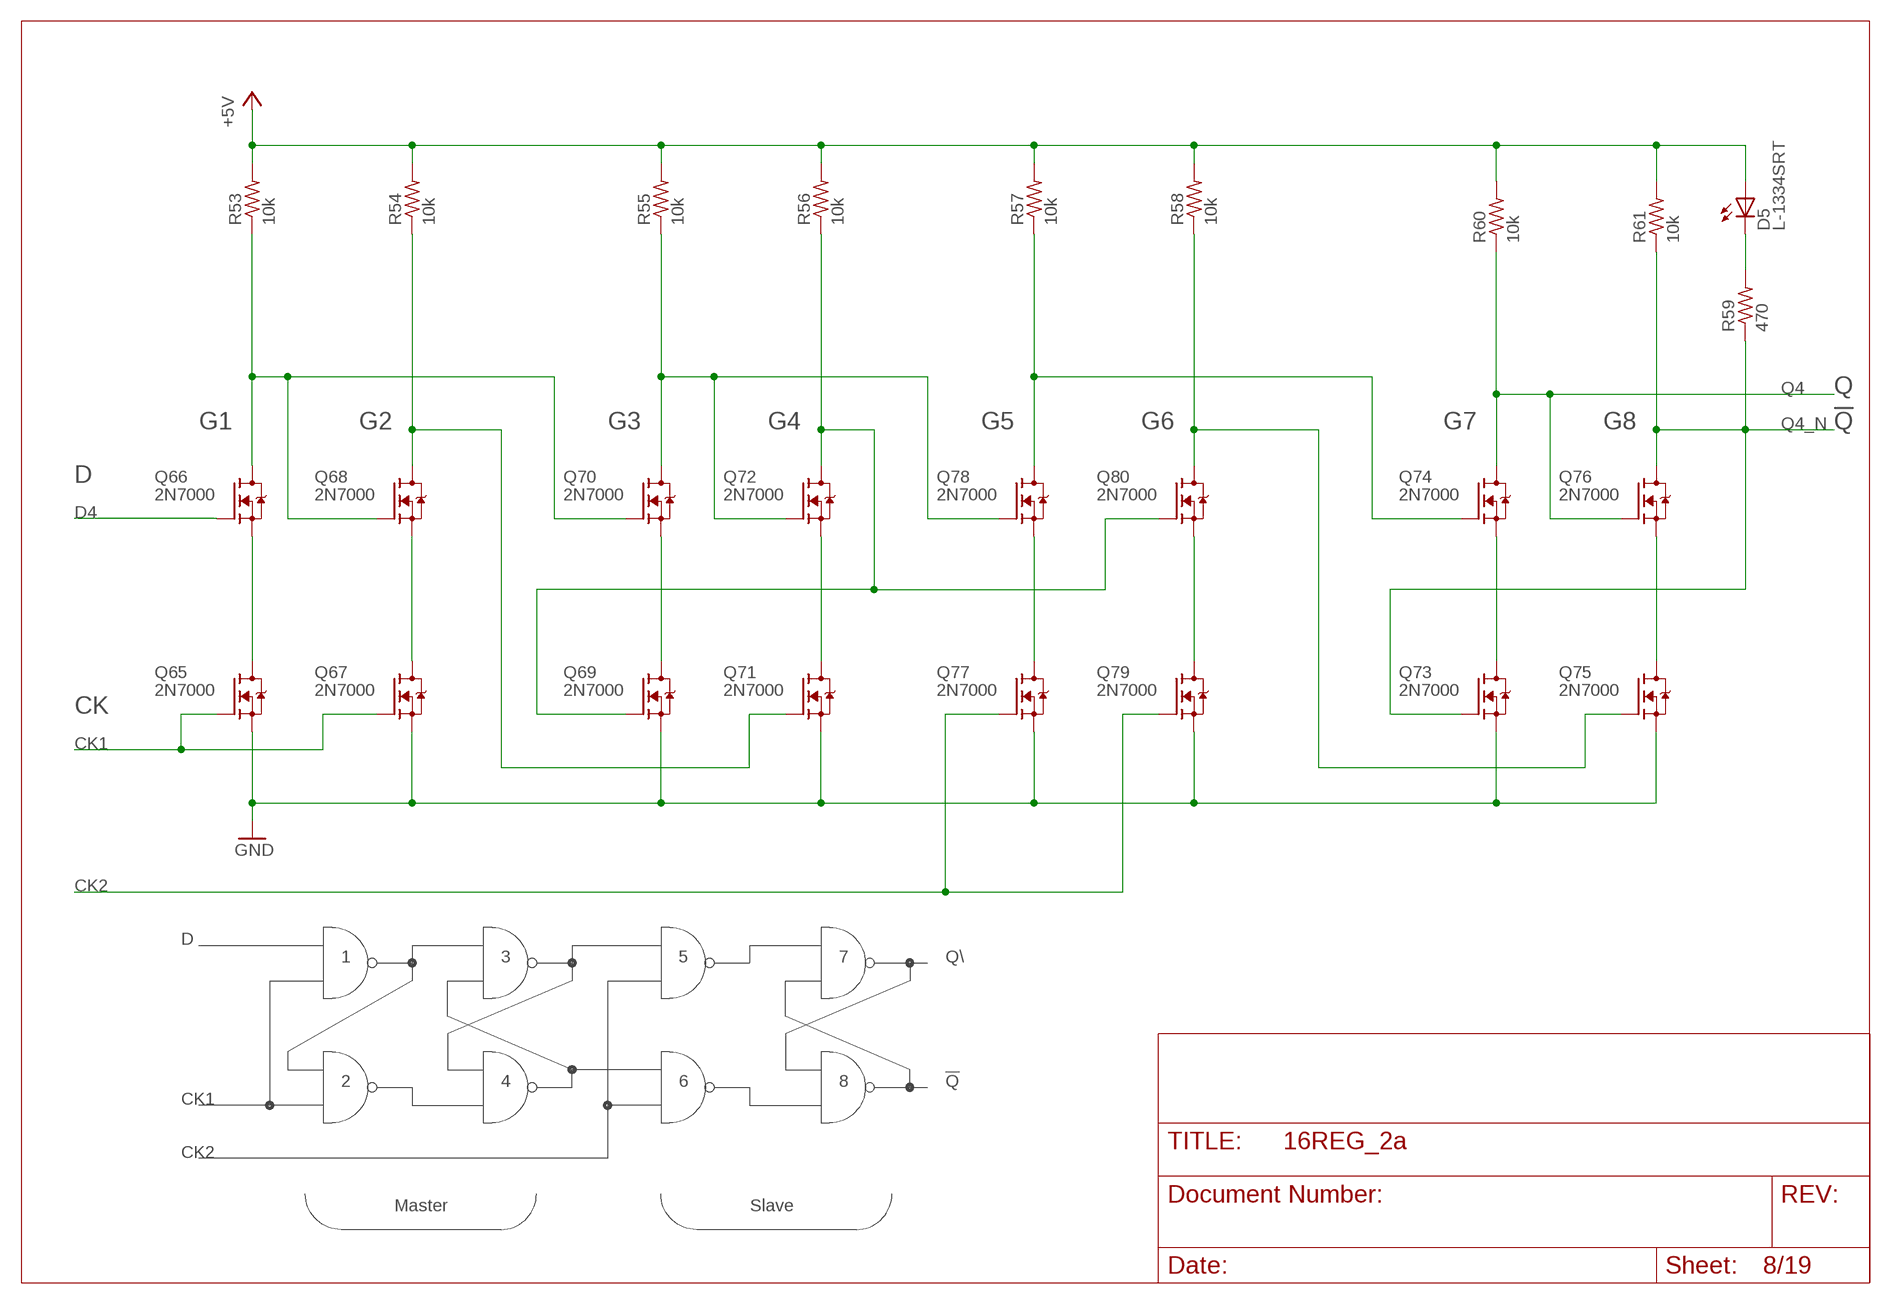
[diagram p7: schematic, sheet 8]

### Parts
D5  L-1334SRT  [LED3MM]
Q65  2N7000  [TO92-DGS]
Q66  2N7000  [TO92-DGS]
Q67  2N7000  [TO92-DGS]
Q68  2N7000  [TO92-DGS]
Q69  2N7000  [TO92-DGS]
Q70  2N7000  [TO92-DGS]
Q71  2N7000  [TO92-DGS]
Q72  2N7000  [TO92-DGS]
Q73  2N7000  [TO92-DGS]
Q74  2N7000  [TO92-DGS]
Q75  2N7000  [TO92-DGS]
Q76  2N7000  [TO92-DGS]
Q77  2N7000  [TO92-DGS]
Q78  2N7000  [TO92-DGS]
Q79  2N7000  [TO92-DGS]
Q80  2N7000  [TO92-DGS]
R53  10k  R_P2INCH  [R_P2INCH]
R54  10k  R_P2INCH  [R_P2INCH]
R55  10k  R_P2INCH  [R_P2INCH]
R56  10k  R_P2INCH  [R_P2INCH]
R57  10k  R_P2INCH  [R_P2INCH]
R58  10k  R_P2INCH  [R_P2INCH]
R59  470  R_P2INCH  [R_P2INCH]
R60  10k  R_P2INCH  [R_P2INCH]
R61  10k  R_P2INCH  [R_P2INCH]

### Nets
+5V: D5.A R53.2 R54.2 R55.2 R56.2 R57.2 R58.2 R60.2 R61.2 ; also sheet 1,3,4,5,6,7,9,10,11,12,13,14,15,16,17,18,19
CK1: Q65.G Q67.G ; also sheet 1,4,5,6,7,9,10,11,12,13,14,15,16,17,18,19
CK2: Q77.G Q79.G ; also sheet 1,4,5,6,7,9,10,11,12,13,14,15,16,17,18,19
D4: Q66.G ; also sheet 1,3
GND: Q65.S Q67.S Q69.S Q71.S Q73.S Q75.S Q77.S Q79.S ; also sheet 1,2,3,4,5,6,7,9,10,11,12,13,14,15,16,17,18,19
N$65: Q65.D Q66.S
N$66: Q67.D Q68.S
N$67: Q69.D Q70.S
N$68: Q71.D Q72.S
N$69: Q73.D Q74.S
N$70: Q75.D Q76.S
N$71: Q66.D Q68.G Q70.G R53.1
N$72: Q69.G Q72.D Q80.G R56.1
N$73: D5.K(C) R59.2
N$74: Q70.D Q72.G Q78.G R55.1
N$75: Q68.D Q71.G R54.1
N$76: Q77.D Q78.S
N$77: Q79.D Q80.S
N$78: Q74.G Q78.D R57.1
N$79: Q75.G Q80.D R58.1
Q4: Q74.D Q76.G R60.1 ; also sheet 1,2
Q4_N: Q73.G Q76.D R59.1 R61.1

### Notes on the sheet
- Q
- G1 | G2 | G3 | G4 | G5 | G6 | G7 | G8 | !Q
- D
- CK
- D
- 1 | 3 | 5 | 7 | Q\
- 2 | 4 | 6 | 8 | !Q
- CK1
- CK2
- Master | Slave

## Sheet 9 of 19
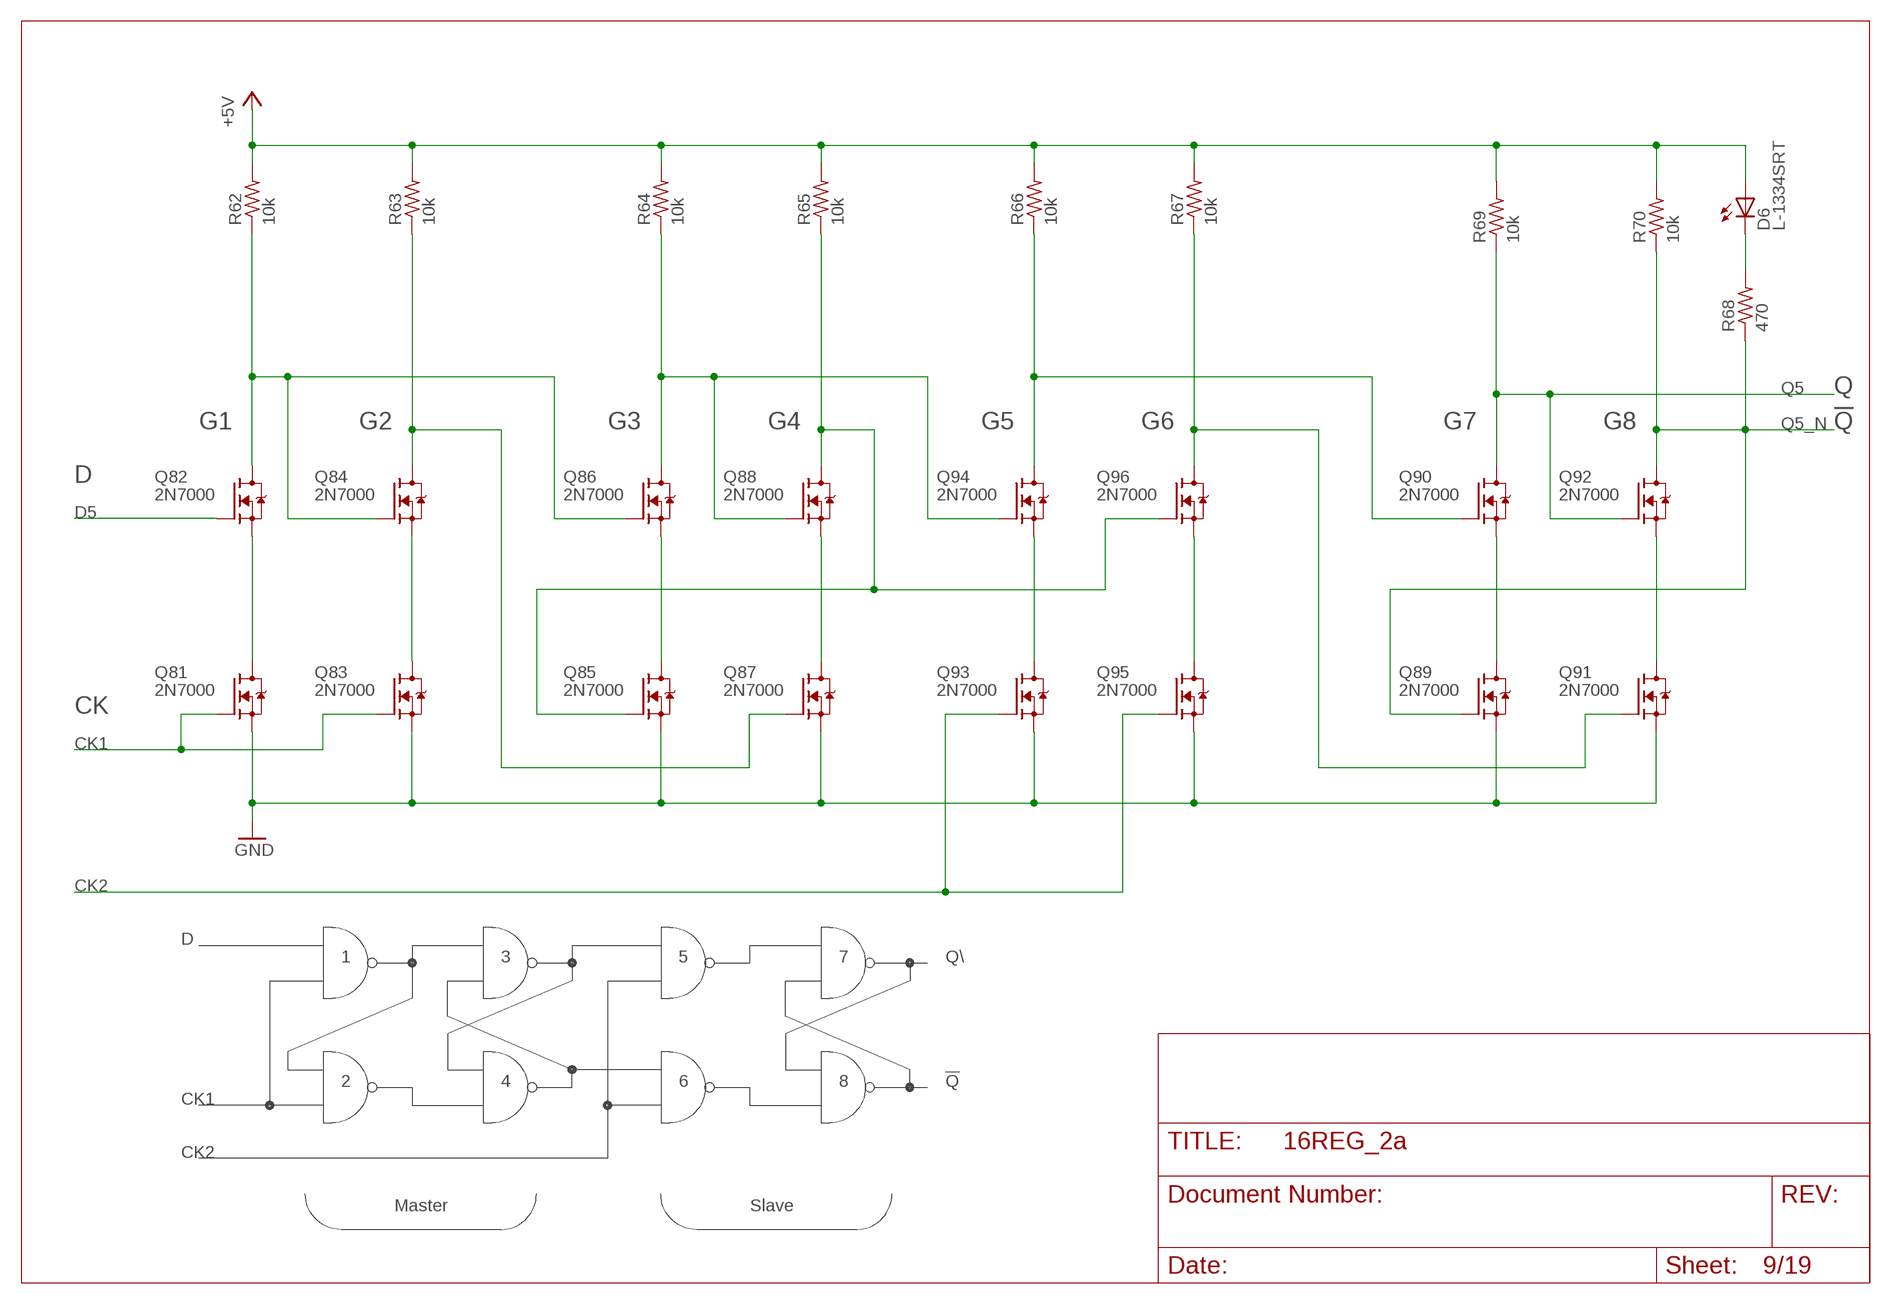
[diagram p8: schematic, sheet 9]

### Parts
D6  L-1334SRT  [LED3MM]
Q81  2N7000  [TO92-DGS]
Q82  2N7000  [TO92-DGS]
Q83  2N7000  [TO92-DGS]
Q84  2N7000  [TO92-DGS]
Q85  2N7000  [TO92-DGS]
Q86  2N7000  [TO92-DGS]
Q87  2N7000  [TO92-DGS]
Q88  2N7000  [TO92-DGS]
Q89  2N7000  [TO92-DGS]
Q90  2N7000  [TO92-DGS]
Q91  2N7000  [TO92-DGS]
Q92  2N7000  [TO92-DGS]
Q93  2N7000  [TO92-DGS]
Q94  2N7000  [TO92-DGS]
Q95  2N7000  [TO92-DGS]
Q96  2N7000  [TO92-DGS]
R62  10k  R_P2INCH  [R_P2INCH]
R63  10k  R_P2INCH  [R_P2INCH]
R64  10k  R_P2INCH  [R_P2INCH]
R65  10k  R_P2INCH  [R_P2INCH]
R66  10k  R_P2INCH  [R_P2INCH]
R67  10k  R_P2INCH  [R_P2INCH]
R68  470  R_P2INCH  [R_P2INCH]
R69  10k  R_P2INCH  [R_P2INCH]
R70  10k  R_P2INCH  [R_P2INCH]

### Nets
+5V: D6.A R62.2 R63.2 R64.2 R65.2 R66.2 R67.2 R69.2 R70.2 ; also sheet 1,3,4,5,6,7,8,10,11,12,13,14,15,16,17,18,19
CK1: Q81.G Q83.G ; also sheet 1,4,5,6,7,8,10,11,12,13,14,15,16,17,18,19
CK2: Q93.G Q95.G ; also sheet 1,4,5,6,7,8,10,11,12,13,14,15,16,17,18,19
D5: Q82.G ; also sheet 1,3
GND: Q81.S Q83.S Q85.S Q87.S Q89.S Q91.S Q93.S Q95.S ; also sheet 1,2,3,4,5,6,7,8,10,11,12,13,14,15,16,17,18,19
N$80: Q81.D Q82.S
N$81: Q83.D Q84.S
N$82: Q85.D Q86.S
N$83: Q87.D Q88.S
N$84: Q89.D Q90.S
N$85: Q91.D Q92.S
N$86: Q82.D Q84.G Q86.G R62.1
N$87: Q85.G Q88.D Q96.G R65.1
N$88: D6.K(C) R68.2
N$89: Q86.D Q88.G Q94.G R64.1
N$90: Q84.D Q87.G R63.1
N$91: Q93.D Q94.S
N$92: Q95.D Q96.S
N$93: Q90.G Q94.D R66.1
N$94: Q91.G Q96.D R67.1
Q5: Q90.D Q92.G R69.1 ; also sheet 1,2
Q5_N: Q89.G Q92.D R68.1 R70.1

### Notes on the sheet
- Q
- G1 | G2 | G3 | G4 | G5 | G6 | G7 | G8 | !Q
- D
- CK
- D
- 1 | 3 | 5 | 7 | Q\
- 2 | 4 | 6 | 8 | !Q
- CK1
- CK2
- Master | Slave

## Sheet 10 of 19
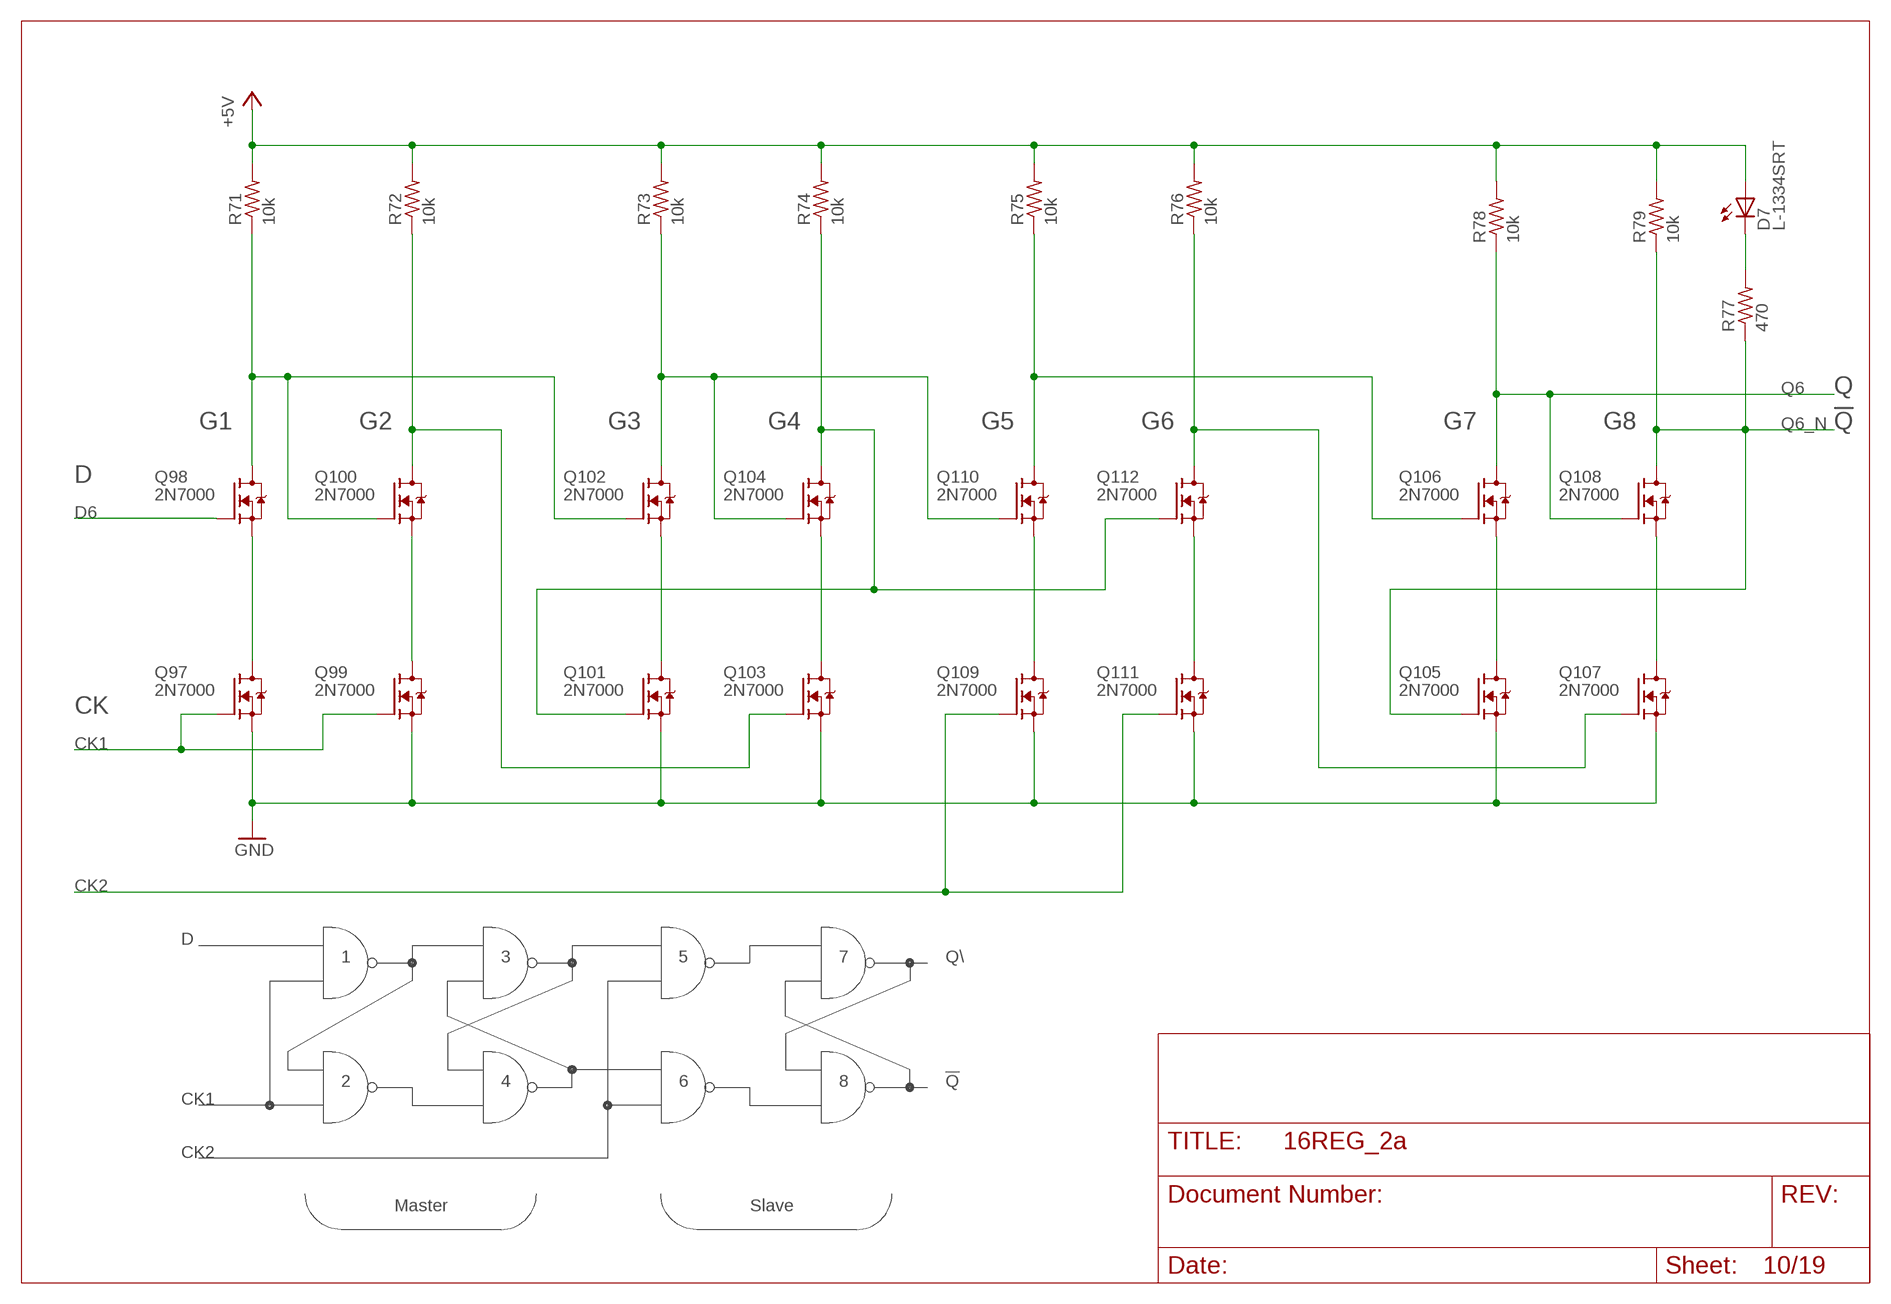
[diagram p9: schematic, sheet 10]

### Parts
D7  L-1334SRT  [LED3MM]
Q97  2N7000  [TO92-DGS]
Q98  2N7000  [TO92-DGS]
Q99  2N7000  [TO92-DGS]
Q100  2N7000  [TO92-DGS]
Q101  2N7000  [TO92-DGS]
Q102  2N7000  [TO92-DGS]
Q103  2N7000  [TO92-DGS]
Q104  2N7000  [TO92-DGS]
Q105  2N7000  [TO92-DGS]
Q106  2N7000  [TO92-DGS]
Q107  2N7000  [TO92-DGS]
Q108  2N7000  [TO92-DGS]
Q109  2N7000  [TO92-DGS]
Q110  2N7000  [TO92-DGS]
Q111  2N7000  [TO92-DGS]
Q112  2N7000  [TO92-DGS]
R71  10k  R_P2INCH  [R_P2INCH]
R72  10k  R_P2INCH  [R_P2INCH]
R73  10k  R_P2INCH  [R_P2INCH]
R74  10k  R_P2INCH  [R_P2INCH]
R75  10k  R_P2INCH  [R_P2INCH]
R76  10k  R_P2INCH  [R_P2INCH]
R77  470  R_P2INCH  [R_P2INCH]
R78  10k  R_P2INCH  [R_P2INCH]
R79  10k  R_P2INCH  [R_P2INCH]

### Nets
+5V: D7.A R71.2 R72.2 R73.2 R74.2 R75.2 R76.2 R78.2 R79.2 ; also sheet 1,3,4,5,6,7,8,9,11,12,13,14,15,16,17,18,19
CK1: Q97.G Q99.G ; also sheet 1,4,5,6,7,8,9,11,12,13,14,15,16,17,18,19
CK2: Q109.G Q111.G ; also sheet 1,4,5,6,7,8,9,11,12,13,14,15,16,17,18,19
D6: Q98.G ; also sheet 1,3
GND: Q97.S Q99.S Q101.S Q103.S Q105.S Q107.S Q109.S Q111.S ; also sheet 1,2,3,4,5,6,7,8,9,11,12,13,14,15,16,17,18,19
N$95: Q97.D Q98.S
N$96: Q99.D Q100.S
N$97: Q101.D Q102.S
N$98: Q103.D Q104.S
N$99: Q105.D Q106.S
N$100: Q107.D Q108.S
N$101: Q98.D Q100.G Q102.G R71.1
N$102: Q101.G Q104.D Q112.G R74.1
N$103: D7.K(C) R77.2
N$104: Q102.D Q104.G Q110.G R73.1
N$105: Q100.D Q103.G R72.1
N$106: Q109.D Q110.S
N$107: Q111.D Q112.S
N$108: Q106.G Q110.D R75.1
N$109: Q107.G Q112.D R76.1
Q6: Q106.D Q108.G R78.1 ; also sheet 1,2
Q6_N: Q105.G Q108.D R77.1 R79.1

### Notes on the sheet
- Q
- G1 | G2 | G3 | G4 | G5 | G6 | G7 | G8 | !Q
- D
- CK
- D
- 1 | 3 | 5 | 7 | Q\
- 2 | 4 | 6 | 8 | !Q
- CK1
- CK2
- Master | Slave

## Sheet 11 of 19
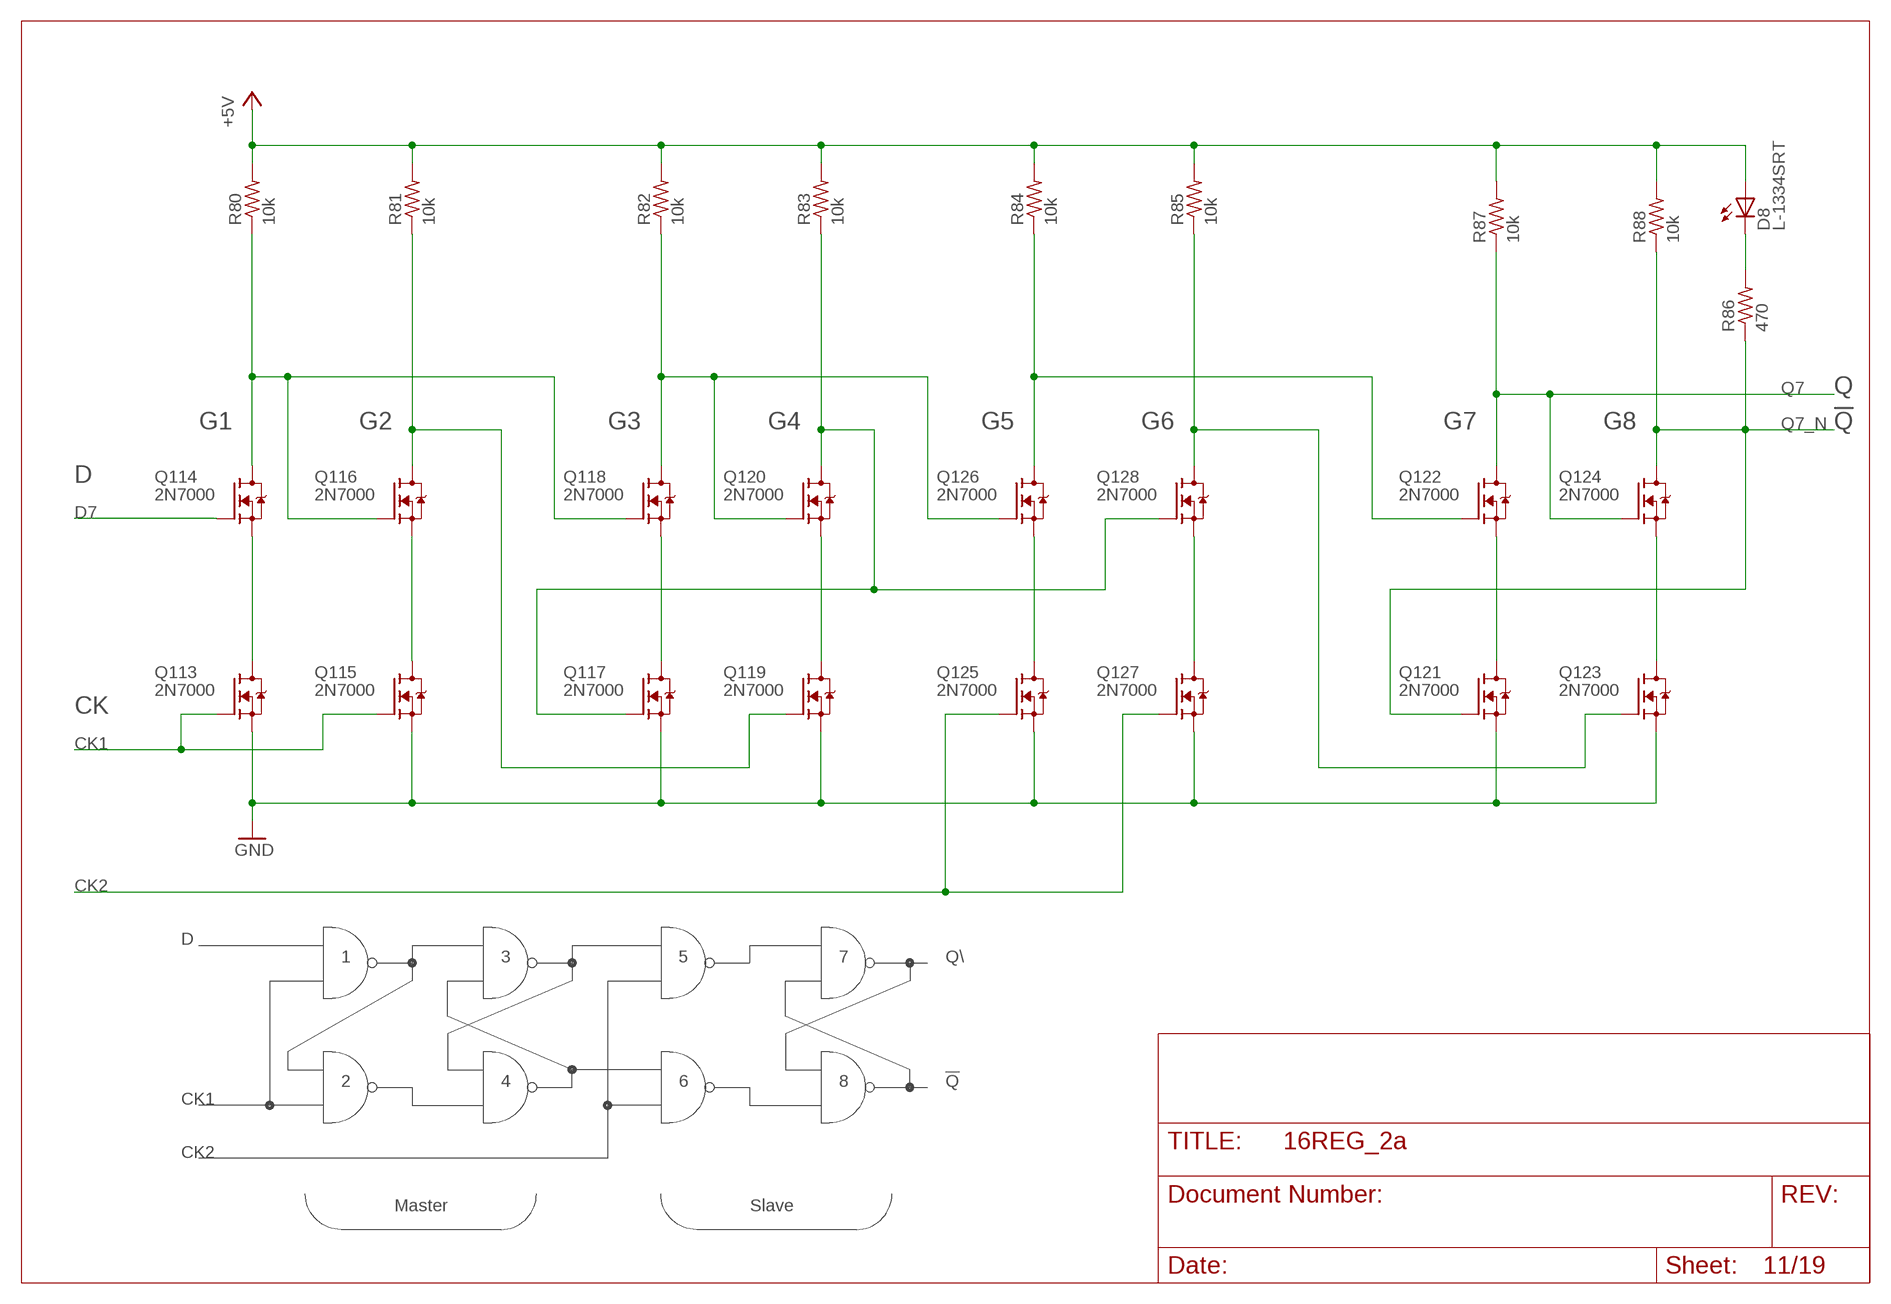
[diagram p10: schematic, sheet 11]

### Parts
D8  L-1334SRT  [LED3MM]
Q113  2N7000  [TO92-DGS]
Q114  2N7000  [TO92-DGS]
Q115  2N7000  [TO92-DGS]
Q116  2N7000  [TO92-DGS]
Q117  2N7000  [TO92-DGS]
Q118  2N7000  [TO92-DGS]
Q119  2N7000  [TO92-DGS]
Q120  2N7000  [TO92-DGS]
Q121  2N7000  [TO92-DGS]
Q122  2N7000  [TO92-DGS]
Q123  2N7000  [TO92-DGS]
Q124  2N7000  [TO92-DGS]
Q125  2N7000  [TO92-DGS]
Q126  2N7000  [TO92-DGS]
Q127  2N7000  [TO92-DGS]
Q128  2N7000  [TO92-DGS]
R80  10k  R_P2INCH  [R_P2INCH]
R81  10k  R_P2INCH  [R_P2INCH]
R82  10k  R_P2INCH  [R_P2INCH]
R83  10k  R_P2INCH  [R_P2INCH]
R84  10k  R_P2INCH  [R_P2INCH]
R85  10k  R_P2INCH  [R_P2INCH]
R86  470  R_P2INCH  [R_P2INCH]
R87  10k  R_P2INCH  [R_P2INCH]
R88  10k  R_P2INCH  [R_P2INCH]

### Nets
+5V: D8.A R80.2 R81.2 R82.2 R83.2 R84.2 R85.2 R87.2 R88.2 ; also sheet 1,3,4,5,6,7,8,9,10,12,13,14,15,16,17,18,19
CK1: Q113.G Q115.G ; also sheet 1,4,5,6,7,8,9,10,12,13,14,15,16,17,18,19
CK2: Q125.G Q127.G ; also sheet 1,4,5,6,7,8,9,10,12,13,14,15,16,17,18,19
D7: Q114.G ; also sheet 1,3
GND: Q113.S Q115.S Q117.S Q119.S Q121.S Q123.S Q125.S Q127.S ; also sheet 1,2,3,4,5,6,7,8,9,10,12,13,14,15,16,17,18,19
N$110: Q113.D Q114.S
N$111: Q115.D Q116.S
N$112: Q117.D Q118.S
N$113: Q119.D Q120.S
N$114: Q121.D Q122.S
N$115: Q123.D Q124.S
N$116: Q114.D Q116.G Q118.G R80.1
N$117: Q117.G Q120.D Q128.G R83.1
N$118: D8.K(C) R86.2
N$119: Q118.D Q120.G Q126.G R82.1
N$120: Q116.D Q119.G R81.1
N$121: Q125.D Q126.S
N$122: Q127.D Q128.S
N$123: Q122.G Q126.D R84.1
N$124: Q123.G Q128.D R85.1
Q7: Q122.D Q124.G R87.1 ; also sheet 1,2
Q7_N: Q121.G Q124.D R86.1 R88.1

### Notes on the sheet
- Q
- G1 | G2 | G3 | G4 | G5 | G6 | G7 | G8 | !Q
- D
- CK
- D
- 1 | 3 | 5 | 7 | Q\
- 2 | 4 | 6 | 8 | !Q
- CK1
- CK2
- Master | Slave

## Sheet 12 of 19
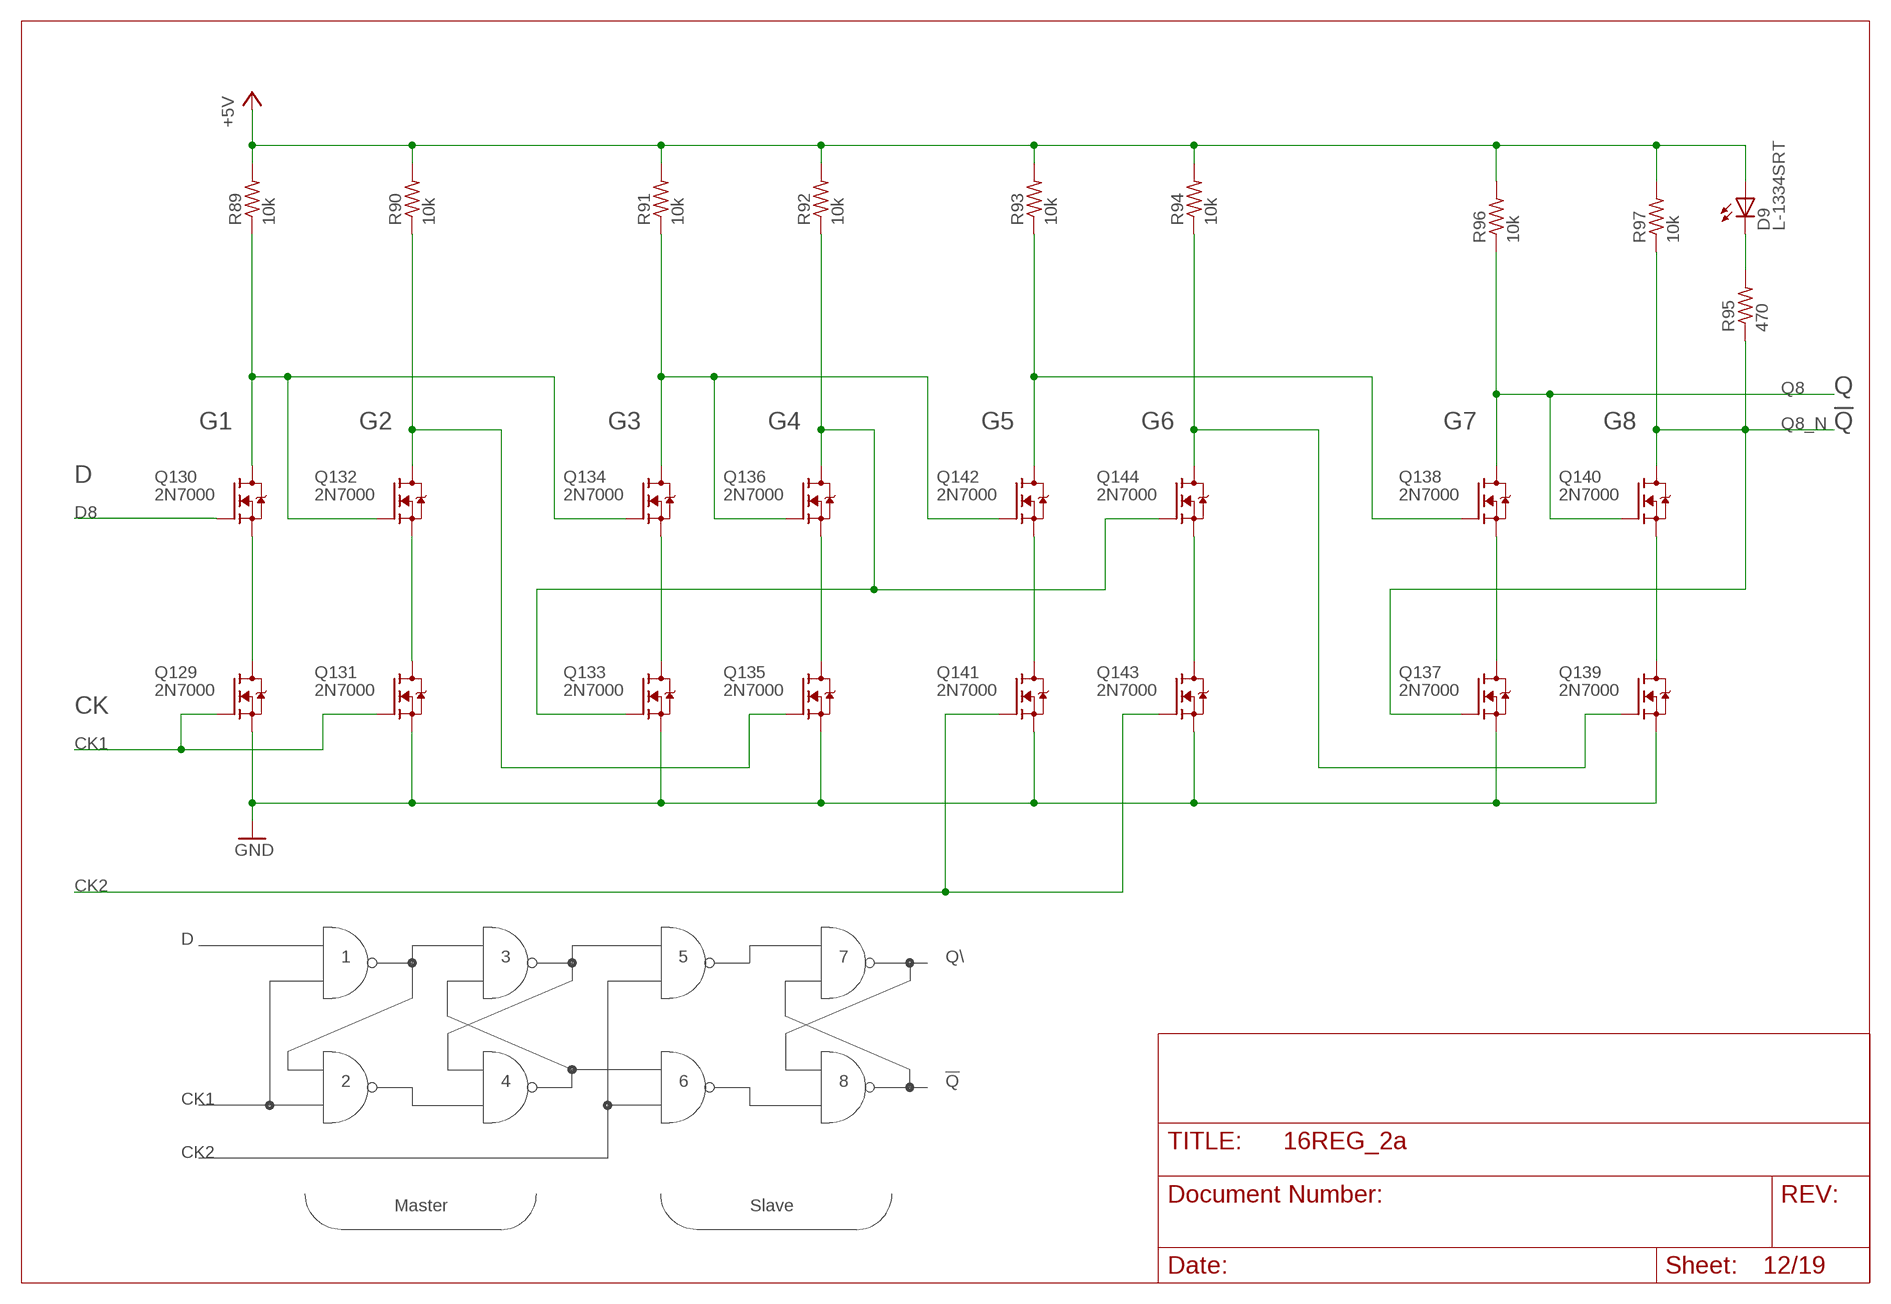
[diagram p11: schematic, sheet 12]

### Parts
D9  L-1334SRT  [LED3MM]
Q129  2N7000  [TO92-DGS]
Q130  2N7000  [TO92-DGS]
Q131  2N7000  [TO92-DGS]
Q132  2N7000  [TO92-DGS]
Q133  2N7000  [TO92-DGS]
Q134  2N7000  [TO92-DGS]
Q135  2N7000  [TO92-DGS]
Q136  2N7000  [TO92-DGS]
Q137  2N7000  [TO92-DGS]
Q138  2N7000  [TO92-DGS]
Q139  2N7000  [TO92-DGS]
Q140  2N7000  [TO92-DGS]
Q141  2N7000  [TO92-DGS]
Q142  2N7000  [TO92-DGS]
Q143  2N7000  [TO92-DGS]
Q144  2N7000  [TO92-DGS]
R89  10k  R_P2INCH  [R_P2INCH]
R90  10k  R_P2INCH  [R_P2INCH]
R91  10k  R_P2INCH  [R_P2INCH]
R92  10k  R_P2INCH  [R_P2INCH]
R93  10k  R_P2INCH  [R_P2INCH]
R94  10k  R_P2INCH  [R_P2INCH]
R95  470  R_P2INCH  [R_P2INCH]
R96  10k  R_P2INCH  [R_P2INCH]
R97  10k  R_P2INCH  [R_P2INCH]

### Nets
+5V: D9.A R89.2 R90.2 R91.2 R92.2 R93.2 R94.2 R96.2 R97.2 ; also sheet 1,3,4,5,6,7,8,9,10,11,13,14,15,16,17,18,19
CK1: Q129.G Q131.G ; also sheet 1,4,5,6,7,8,9,10,11,13,14,15,16,17,18,19
CK2: Q141.G Q143.G ; also sheet 1,4,5,6,7,8,9,10,11,13,14,15,16,17,18,19
D8: Q130.G ; also sheet 1,3
GND: Q129.S Q131.S Q133.S Q135.S Q137.S Q139.S Q141.S Q143.S ; also sheet 1,2,3,4,5,6,7,8,9,10,11,13,14,15,16,17,18,19
N$125: Q129.D Q130.S
N$126: Q131.D Q132.S
N$127: Q133.D Q134.S
N$128: Q135.D Q136.S
N$129: Q137.D Q138.S
N$130: Q139.D Q140.S
N$131: Q130.D Q132.G Q134.G R89.1
N$132: Q133.G Q136.D Q144.G R92.1
N$133: D9.K(C) R95.2
N$134: Q134.D Q136.G Q142.G R91.1
N$135: Q132.D Q135.G R90.1
N$136: Q141.D Q142.S
N$137: Q143.D Q144.S
N$138: Q138.G Q142.D R93.1
N$139: Q139.G Q144.D R94.1
Q8: Q138.D Q140.G R96.1 ; also sheet 1,2
Q8_N: Q137.G Q140.D R95.1 R97.1

### Notes on the sheet
- Q
- G1 | G2 | G3 | G4 | G5 | G6 | G7 | G8 | !Q
- D
- CK
- D
- 1 | 3 | 5 | 7 | Q\
- 2 | 4 | 6 | 8 | !Q
- CK1
- CK2
- Master | Slave

## Sheet 13 of 19
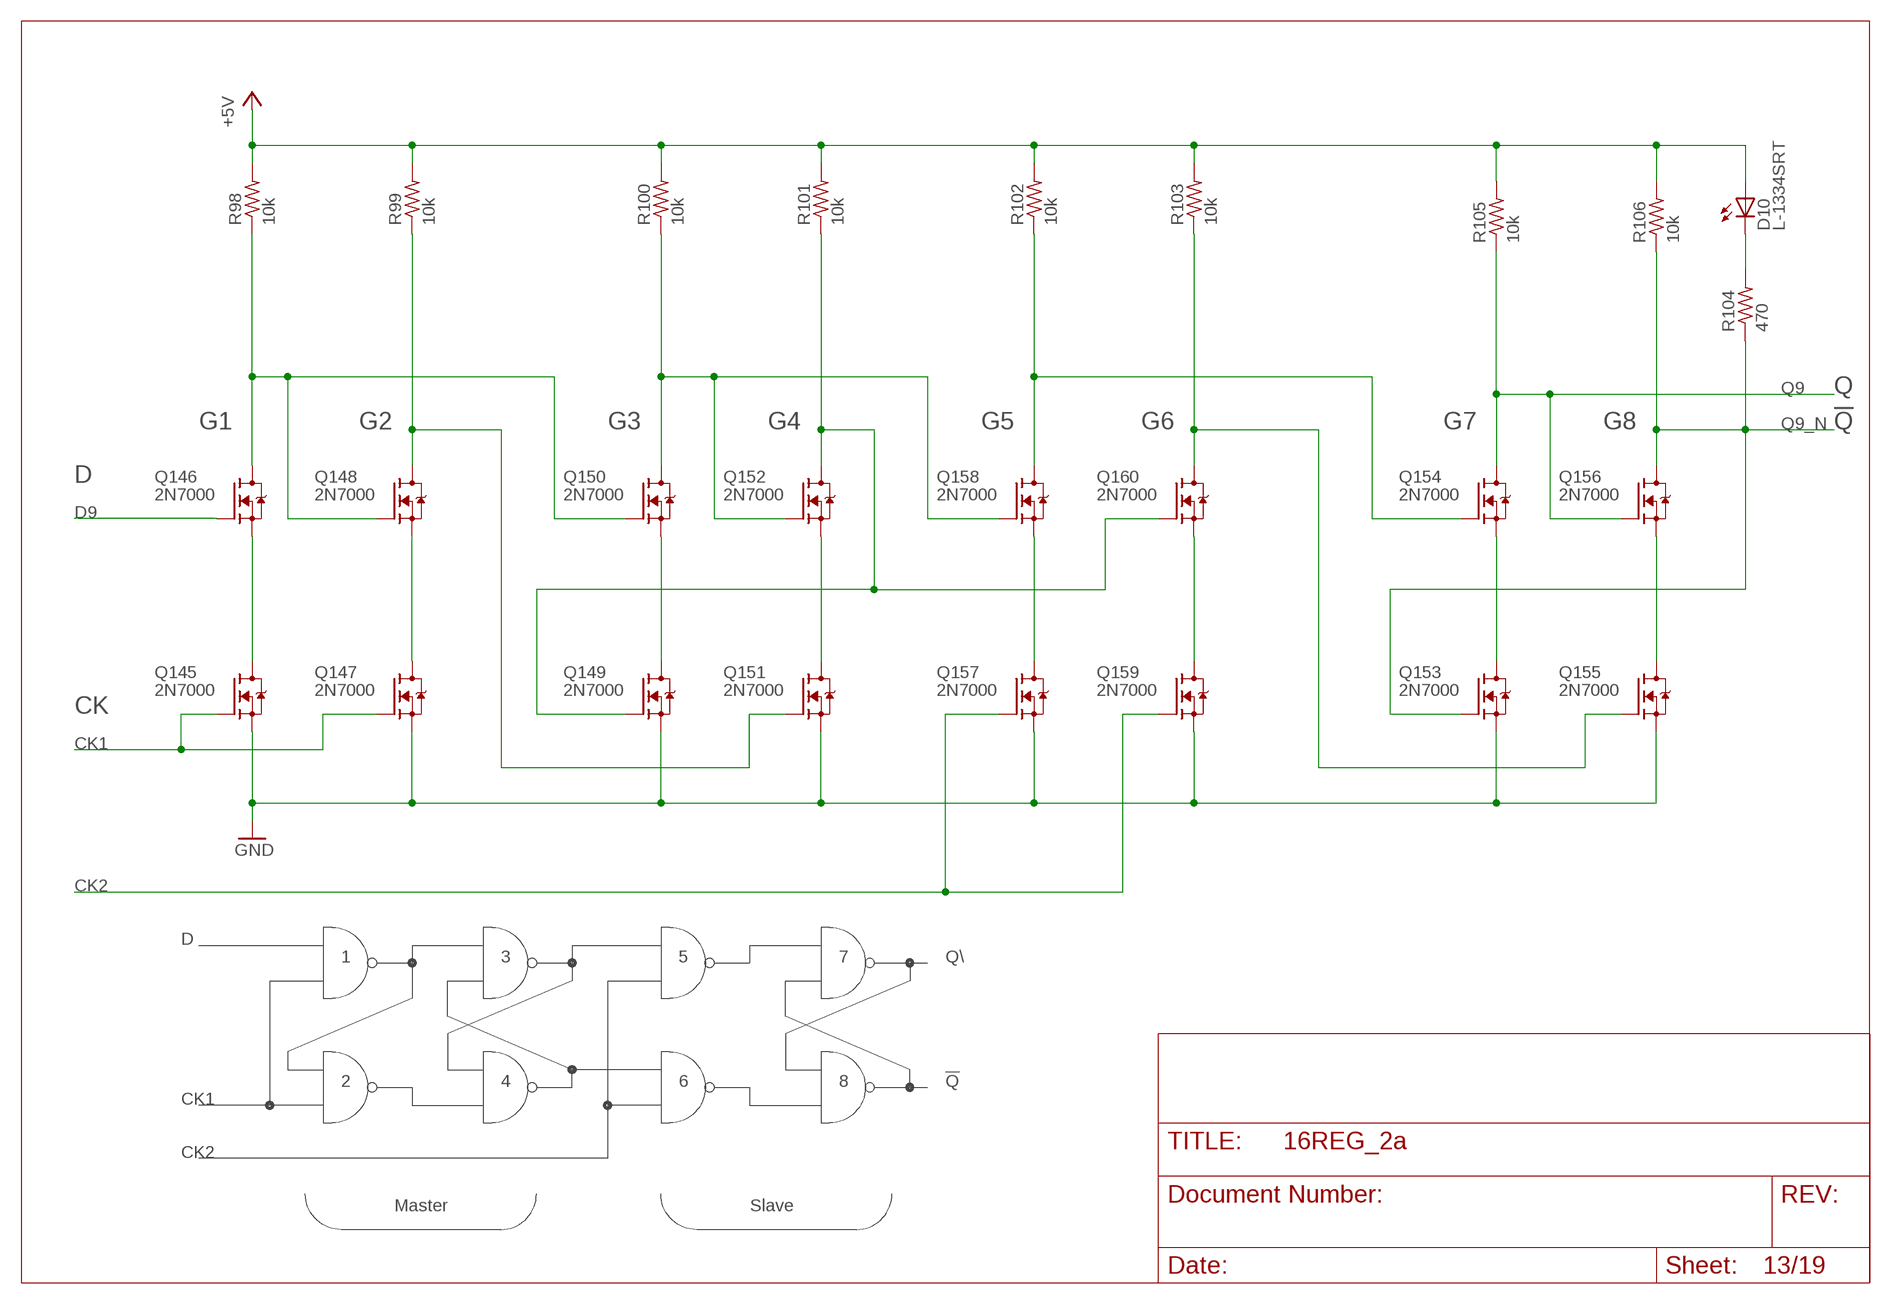
[diagram p12: schematic, sheet 13]

### Parts
D10  L-1334SRT  [LED3MM]
Q145  2N7000  [TO92-DGS]
Q146  2N7000  [TO92-DGS]
Q147  2N7000  [TO92-DGS]
Q148  2N7000  [TO92-DGS]
Q149  2N7000  [TO92-DGS]
Q150  2N7000  [TO92-DGS]
Q151  2N7000  [TO92-DGS]
Q152  2N7000  [TO92-DGS]
Q153  2N7000  [TO92-DGS]
Q154  2N7000  [TO92-DGS]
Q155  2N7000  [TO92-DGS]
Q156  2N7000  [TO92-DGS]
Q157  2N7000  [TO92-DGS]
Q158  2N7000  [TO92-DGS]
Q159  2N7000  [TO92-DGS]
Q160  2N7000  [TO92-DGS]
R98  10k  R_P2INCH  [R_P2INCH]
R99  10k  R_P2INCH  [R_P2INCH]
R100  10k  R_P2INCH  [R_P2INCH]
R101  10k  R_P2INCH  [R_P2INCH]
R102  10k  R_P2INCH  [R_P2INCH]
R103  10k  R_P2INCH  [R_P2INCH]
R104  470  R_P2INCH  [R_P2INCH]
R105  10k  R_P2INCH  [R_P2INCH]
R106  10k  R_P2INCH  [R_P2INCH]

### Nets
+5V: D10.A R98.2 R99.2 R100.2 R101.2 R102.2 R103.2 R105.2 R106.2 ; also sheet 1,3,4,5,6,7,8,9,10,11,12,14,15,16,17,18,19
CK1: Q145.G Q147.G ; also sheet 1,4,5,6,7,8,9,10,11,12,14,15,16,17,18,19
CK2: Q157.G Q159.G ; also sheet 1,4,5,6,7,8,9,10,11,12,14,15,16,17,18,19
D9: Q146.G ; also sheet 1,3
GND: Q145.S Q147.S Q149.S Q151.S Q153.S Q155.S Q157.S Q159.S ; also sheet 1,2,3,4,5,6,7,8,9,10,11,12,14,15,16,17,18,19
N$140: Q145.D Q146.S
N$141: Q147.D Q148.S
N$142: Q149.D Q150.S
N$143: Q151.D Q152.S
N$144: Q153.D Q154.S
N$145: Q155.D Q156.S
N$146: Q146.D Q148.G Q150.G R98.1
N$147: Q149.G Q152.D Q160.G R101.1
N$148: D10.K(C) R104.2
N$149: Q150.D Q152.G Q158.G R100.1
N$150: Q148.D Q151.G R99.1
N$151: Q157.D Q158.S
N$152: Q159.D Q160.S
N$153: Q154.G Q158.D R102.1
N$154: Q155.G Q160.D R103.1
Q9: Q154.D Q156.G R105.1 ; also sheet 1,2
Q9_N: Q153.G Q156.D R104.1 R106.1

### Notes on the sheet
- Q
- G1 | G2 | G3 | G4 | G5 | G6 | G7 | G8 | !Q
- D
- CK
- D
- 1 | 3 | 5 | 7 | Q\
- 2 | 4 | 6 | 8 | !Q
- CK1
- CK2
- Master | Slave

## Sheet 14 of 19
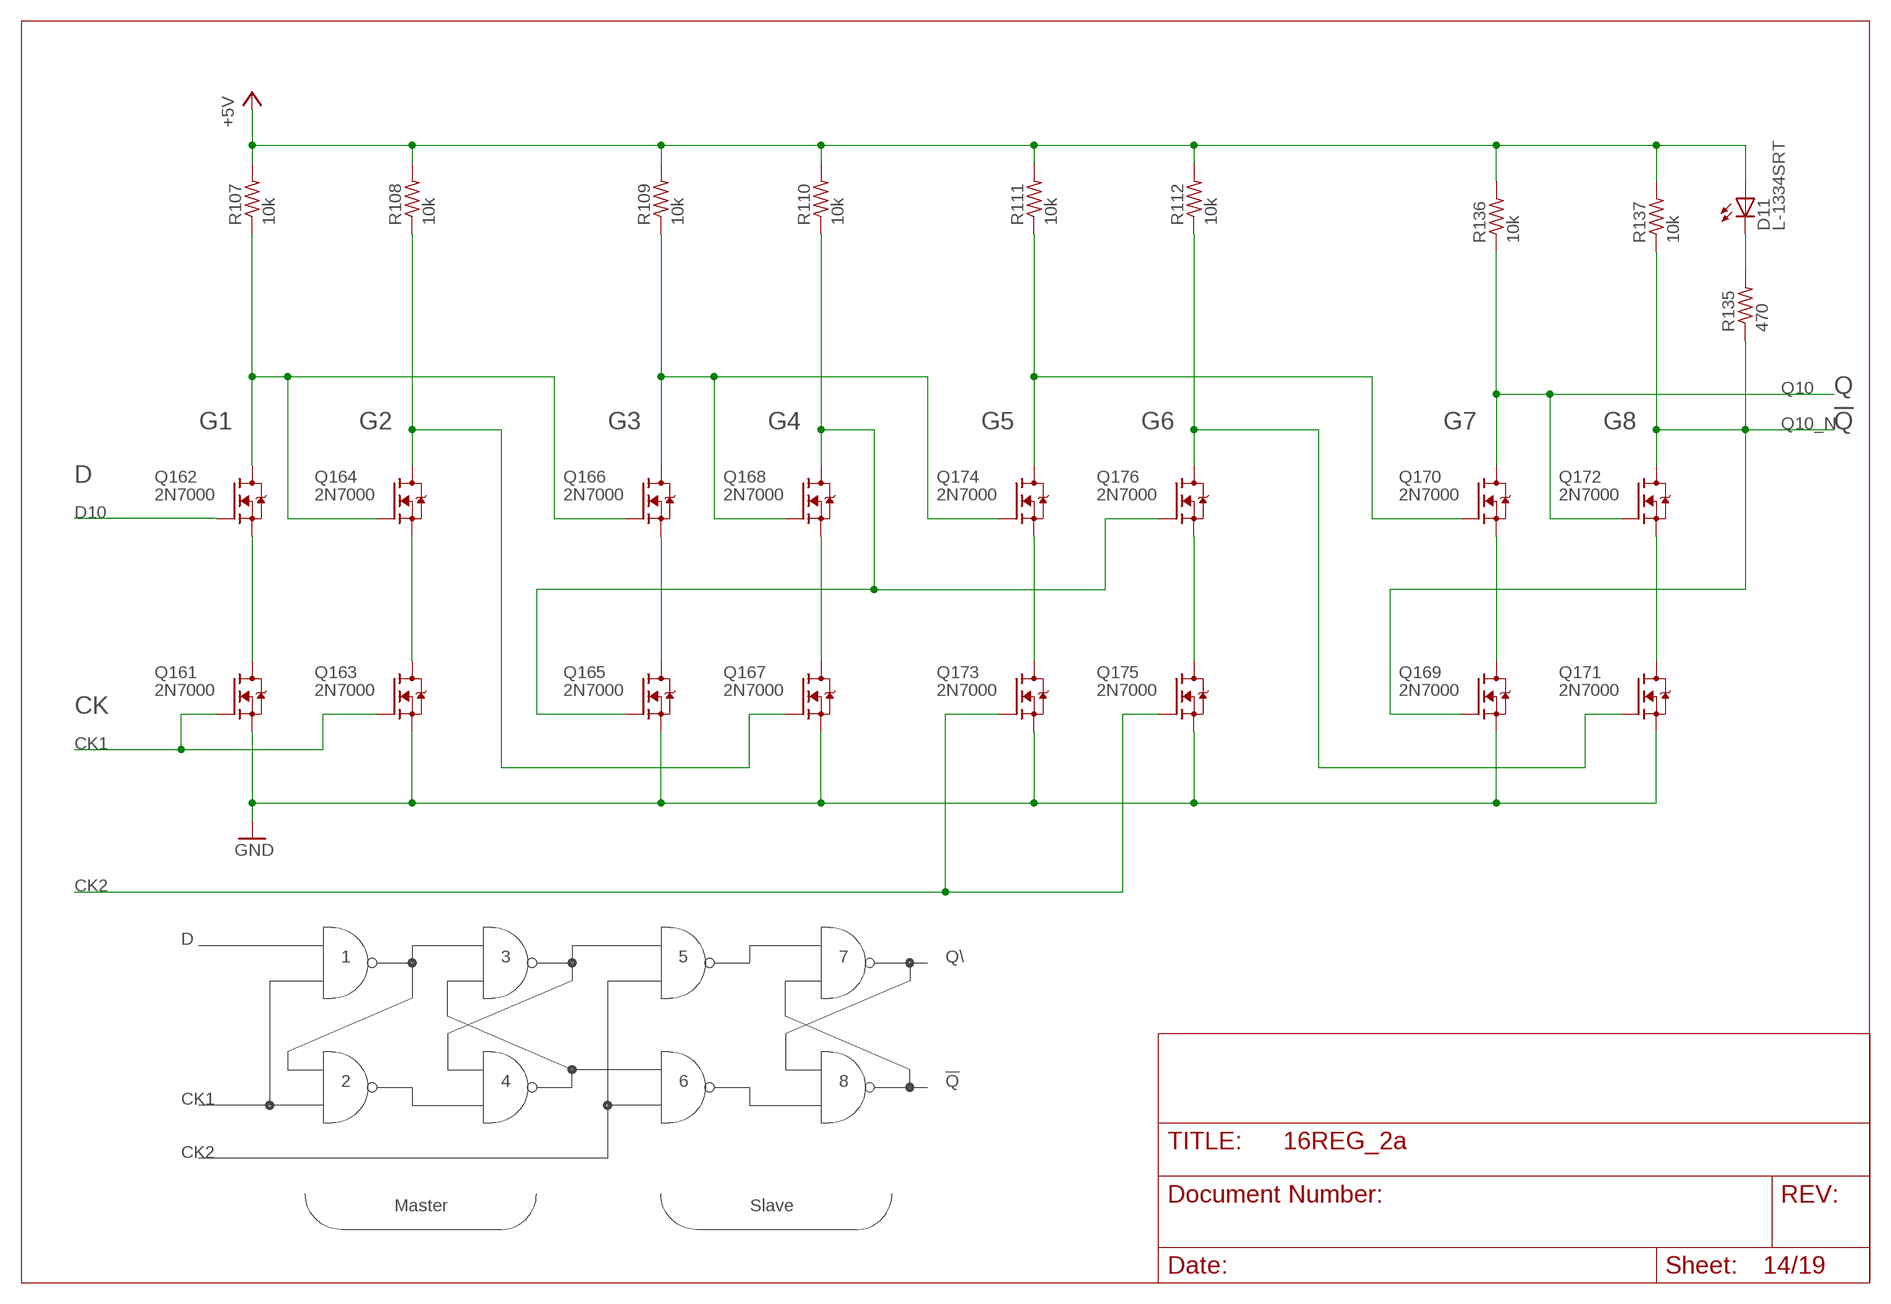
[diagram p13: schematic, sheet 14]

### Parts
D11  L-1334SRT  [LED3MM]
Q161  2N7000  [TO92-DGS]
Q162  2N7000  [TO92-DGS]
Q163  2N7000  [TO92-DGS]
Q164  2N7000  [TO92-DGS]
Q165  2N7000  [TO92-DGS]
Q166  2N7000  [TO92-DGS]
Q167  2N7000  [TO92-DGS]
Q168  2N7000  [TO92-DGS]
Q169  2N7000  [TO92-DGS]
Q170  2N7000  [TO92-DGS]
Q171  2N7000  [TO92-DGS]
Q172  2N7000  [TO92-DGS]
Q173  2N7000  [TO92-DGS]
Q174  2N7000  [TO92-DGS]
Q175  2N7000  [TO92-DGS]
Q176  2N7000  [TO92-DGS]
R107  10k  R_P2INCH  [R_P2INCH]
R108  10k  R_P2INCH  [R_P2INCH]
R109  10k  R_P2INCH  [R_P2INCH]
R110  10k  R_P2INCH  [R_P2INCH]
R111  10k  R_P2INCH  [R_P2INCH]
R112  10k  R_P2INCH  [R_P2INCH]
R135  470  R_P2INCH  [R_P2INCH]
R136  10k  R_P2INCH  [R_P2INCH]
R137  10k  R_P2INCH  [R_P2INCH]

### Nets
+5V: D11.A R107.2 R108.2 R109.2 R110.2 R111.2 R112.2 R136.2 R137.2 ; also sheet 1,3,4,5,6,7,8,9,10,11,12,13,15,16,17,18,19
CK1: Q161.G Q163.G ; also sheet 1,4,5,6,7,8,9,10,11,12,13,15,16,17,18,19
CK2: Q173.G Q175.G ; also sheet 1,4,5,6,7,8,9,10,11,12,13,15,16,17,18,19
D10: Q162.G ; also sheet 1,3
GND: Q161.S Q163.S Q165.S Q167.S Q169.S Q171.S Q173.S Q175.S ; also sheet 1,2,3,4,5,6,7,8,9,10,11,12,13,15,16,17,18,19
N$155: Q161.D Q162.S
N$156: Q163.D Q164.S
N$157: Q165.D Q166.S
N$158: Q167.D Q168.S
N$159: Q169.D Q170.S
N$160: Q171.D Q172.S
N$161: Q162.D Q164.G Q166.G R107.1
N$162: Q165.G Q168.D Q176.G R110.1
N$163: D11.K(C) R135.2
N$164: Q166.D Q168.G Q174.G R109.1
N$165: Q164.D Q167.G R108.1
N$166: Q173.D Q174.S
N$167: Q175.D Q176.S
N$168: Q170.G Q174.D R111.1
N$169: Q171.G Q176.D R112.1
Q10: Q170.D Q172.G R136.1 ; also sheet 1,2
Q10_N: Q169.G Q172.D R135.1 R137.1

### Notes on the sheet
- Q
- G1 | G2 | G3 | G4 | G5 | G6 | G7 | G8 | !Q
- D
- CK
- D
- 1 | 3 | 5 | 7 | Q\
- 2 | 4 | 6 | 8 | !Q
- CK1
- CK2
- Master | Slave

## Sheet 15 of 19
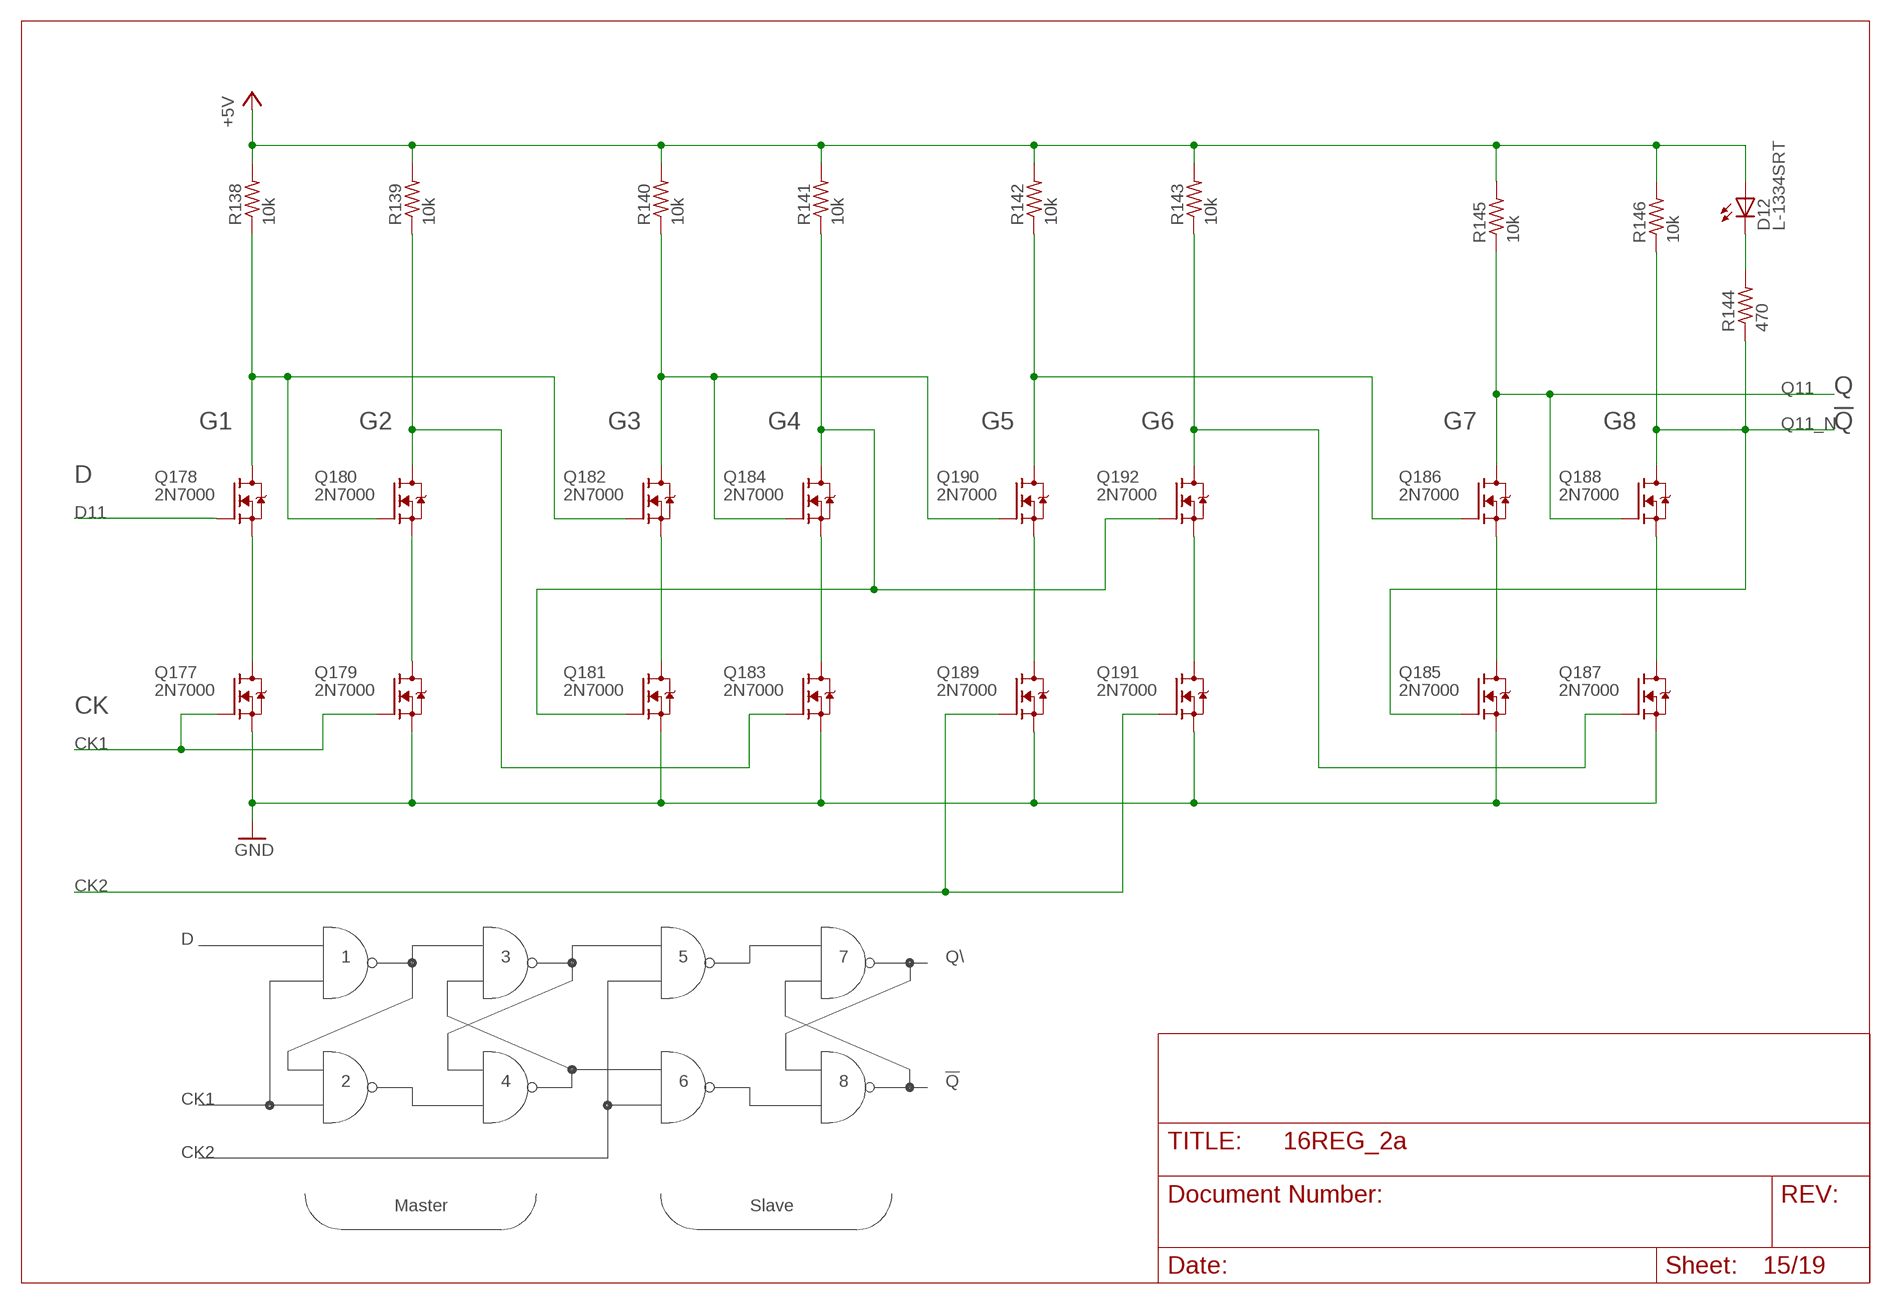
[diagram p14: schematic, sheet 15]

### Parts
D12  L-1334SRT  [LED3MM]
Q177  2N7000  [TO92-DGS]
Q178  2N7000  [TO92-DGS]
Q179  2N7000  [TO92-DGS]
Q180  2N7000  [TO92-DGS]
Q181  2N7000  [TO92-DGS]
Q182  2N7000  [TO92-DGS]
Q183  2N7000  [TO92-DGS]
Q184  2N7000  [TO92-DGS]
Q185  2N7000  [TO92-DGS]
Q186  2N7000  [TO92-DGS]
Q187  2N7000  [TO92-DGS]
Q188  2N7000  [TO92-DGS]
Q189  2N7000  [TO92-DGS]
Q190  2N7000  [TO92-DGS]
Q191  2N7000  [TO92-DGS]
Q192  2N7000  [TO92-DGS]
R138  10k  R_P2INCH  [R_P2INCH]
R139  10k  R_P2INCH  [R_P2INCH]
R140  10k  R_P2INCH  [R_P2INCH]
R141  10k  R_P2INCH  [R_P2INCH]
R142  10k  R_P2INCH  [R_P2INCH]
R143  10k  R_P2INCH  [R_P2INCH]
R144  470  R_P2INCH  [R_P2INCH]
R145  10k  R_P2INCH  [R_P2INCH]
R146  10k  R_P2INCH  [R_P2INCH]

### Nets
+5V: D12.A R138.2 R139.2 R140.2 R141.2 R142.2 R143.2 R145.2 R146.2 ; also sheet 1,3,4,5,6,7,8,9,10,11,12,13,14,16,17,18,19
CK1: Q177.G Q179.G ; also sheet 1,4,5,6,7,8,9,10,11,12,13,14,16,17,18,19
CK2: Q189.G Q191.G ; also sheet 1,4,5,6,7,8,9,10,11,12,13,14,16,17,18,19
D11: Q178.G ; also sheet 1,3
GND: Q177.S Q179.S Q181.S Q183.S Q185.S Q187.S Q189.S Q191.S ; also sheet 1,2,3,4,5,6,7,8,9,10,11,12,13,14,16,17,18,19
N$170: Q177.D Q178.S
N$171: Q179.D Q180.S
N$172: Q181.D Q182.S
N$173: Q183.D Q184.S
N$174: Q185.D Q186.S
N$175: Q187.D Q188.S
N$176: Q178.D Q180.G Q182.G R138.1
N$177: Q181.G Q184.D Q192.G R141.1
N$178: D12.K(C) R144.2
N$179: Q182.D Q184.G Q190.G R140.1
N$180: Q180.D Q183.G R139.1
N$181: Q189.D Q190.S
N$182: Q191.D Q192.S
N$183: Q186.G Q190.D R142.1
N$184: Q187.G Q192.D R143.1
Q11: Q186.D Q188.G R145.1 ; also sheet 1,2
Q11_N: Q185.G Q188.D R144.1 R146.1

### Notes on the sheet
- Q
- G1 | G2 | G3 | G4 | G5 | G6 | G7 | G8 | !Q
- D
- CK
- D
- 1 | 3 | 5 | 7 | Q\
- 2 | 4 | 6 | 8 | !Q
- CK1
- CK2
- Master | Slave

## Sheet 16 of 19
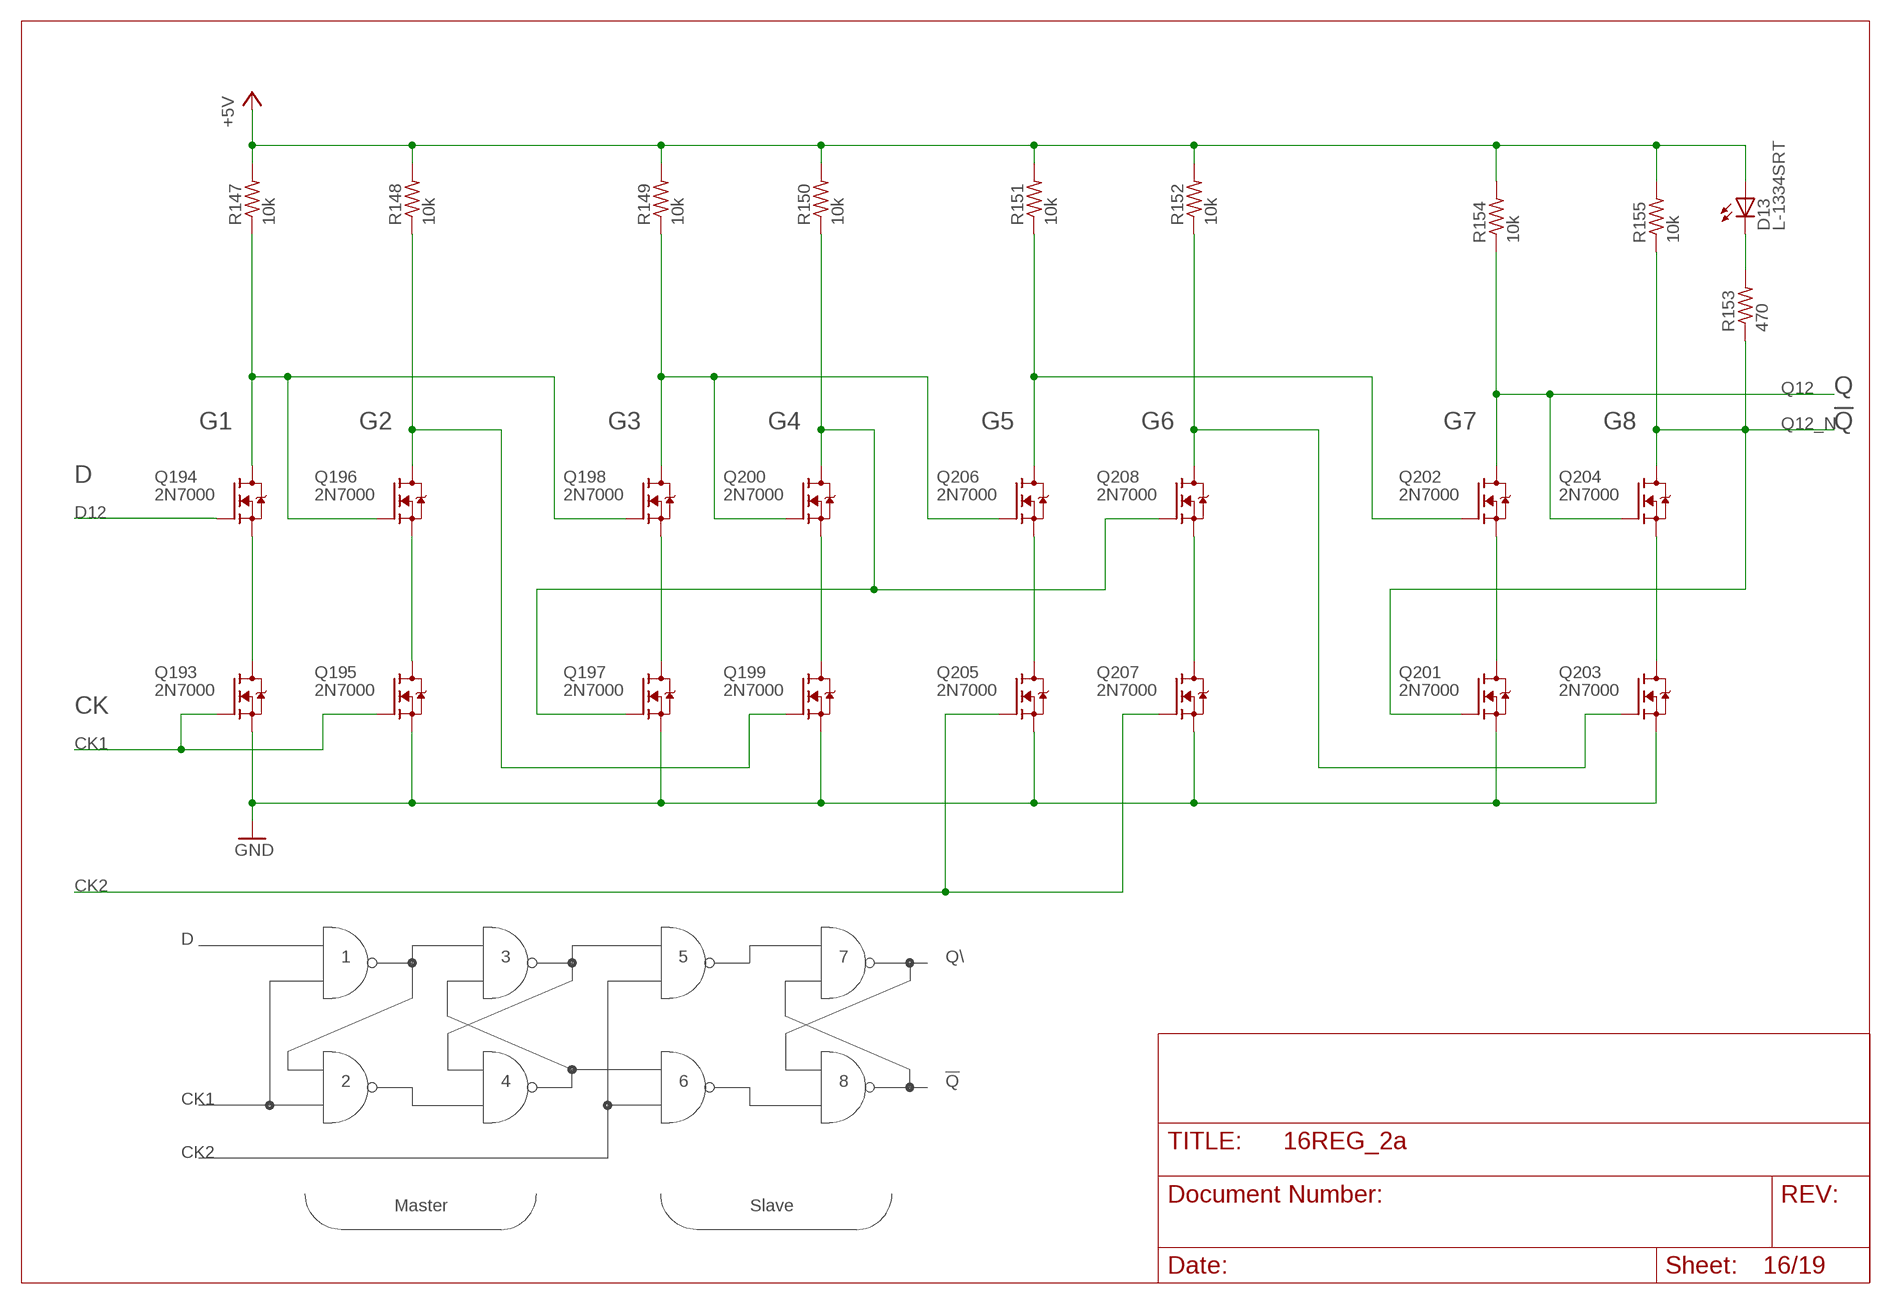
[diagram p15: schematic, sheet 16]

### Parts
D13  L-1334SRT  [LED3MM]
Q193  2N7000  [TO92-DGS]
Q194  2N7000  [TO92-DGS]
Q195  2N7000  [TO92-DGS]
Q196  2N7000  [TO92-DGS]
Q197  2N7000  [TO92-DGS]
Q198  2N7000  [TO92-DGS]
Q199  2N7000  [TO92-DGS]
Q200  2N7000  [TO92-DGS]
Q201  2N7000  [TO92-DGS]
Q202  2N7000  [TO92-DGS]
Q203  2N7000  [TO92-DGS]
Q204  2N7000  [TO92-DGS]
Q205  2N7000  [TO92-DGS]
Q206  2N7000  [TO92-DGS]
Q207  2N7000  [TO92-DGS]
Q208  2N7000  [TO92-DGS]
R147  10k  R_P2INCH  [R_P2INCH]
R148  10k  R_P2INCH  [R_P2INCH]
R149  10k  R_P2INCH  [R_P2INCH]
R150  10k  R_P2INCH  [R_P2INCH]
R151  10k  R_P2INCH  [R_P2INCH]
R152  10k  R_P2INCH  [R_P2INCH]
R153  470  R_P2INCH  [R_P2INCH]
R154  10k  R_P2INCH  [R_P2INCH]
R155  10k  R_P2INCH  [R_P2INCH]

### Nets
+5V: D13.A R147.2 R148.2 R149.2 R150.2 R151.2 R152.2 R154.2 R155.2 ; also sheet 1,3,4,5,6,7,8,9,10,11,12,13,14,15,17,18,19
CK1: Q193.G Q195.G ; also sheet 1,4,5,6,7,8,9,10,11,12,13,14,15,17,18,19
CK2: Q205.G Q207.G ; also sheet 1,4,5,6,7,8,9,10,11,12,13,14,15,17,18,19
D12: Q194.G ; also sheet 1,3
GND: Q193.S Q195.S Q197.S Q199.S Q201.S Q203.S Q205.S Q207.S ; also sheet 1,2,3,4,5,6,7,8,9,10,11,12,13,14,15,17,18,19
N$185: Q193.D Q194.S
N$186: Q195.D Q196.S
N$187: Q197.D Q198.S
N$188: Q199.D Q200.S
N$189: Q201.D Q202.S
N$190: Q203.D Q204.S
N$191: Q194.D Q196.G Q198.G R147.1
N$192: Q197.G Q200.D Q208.G R150.1
N$193: D13.K(C) R153.2
N$194: Q198.D Q200.G Q206.G R149.1
N$195: Q196.D Q199.G R148.1
N$196: Q205.D Q206.S
N$197: Q207.D Q208.S
N$198: Q202.G Q206.D R151.1
N$199: Q203.G Q208.D R152.1
Q12: Q202.D Q204.G R154.1 ; also sheet 1,2
Q12_N: Q201.G Q204.D R153.1 R155.1

### Notes on the sheet
- Q
- G1 | G2 | G3 | G4 | G5 | G6 | G7 | G8 | !Q
- D
- CK
- D
- 1 | 3 | 5 | 7 | Q\
- 2 | 4 | 6 | 8 | !Q
- CK1
- CK2
- Master | Slave

## Sheet 17 of 19
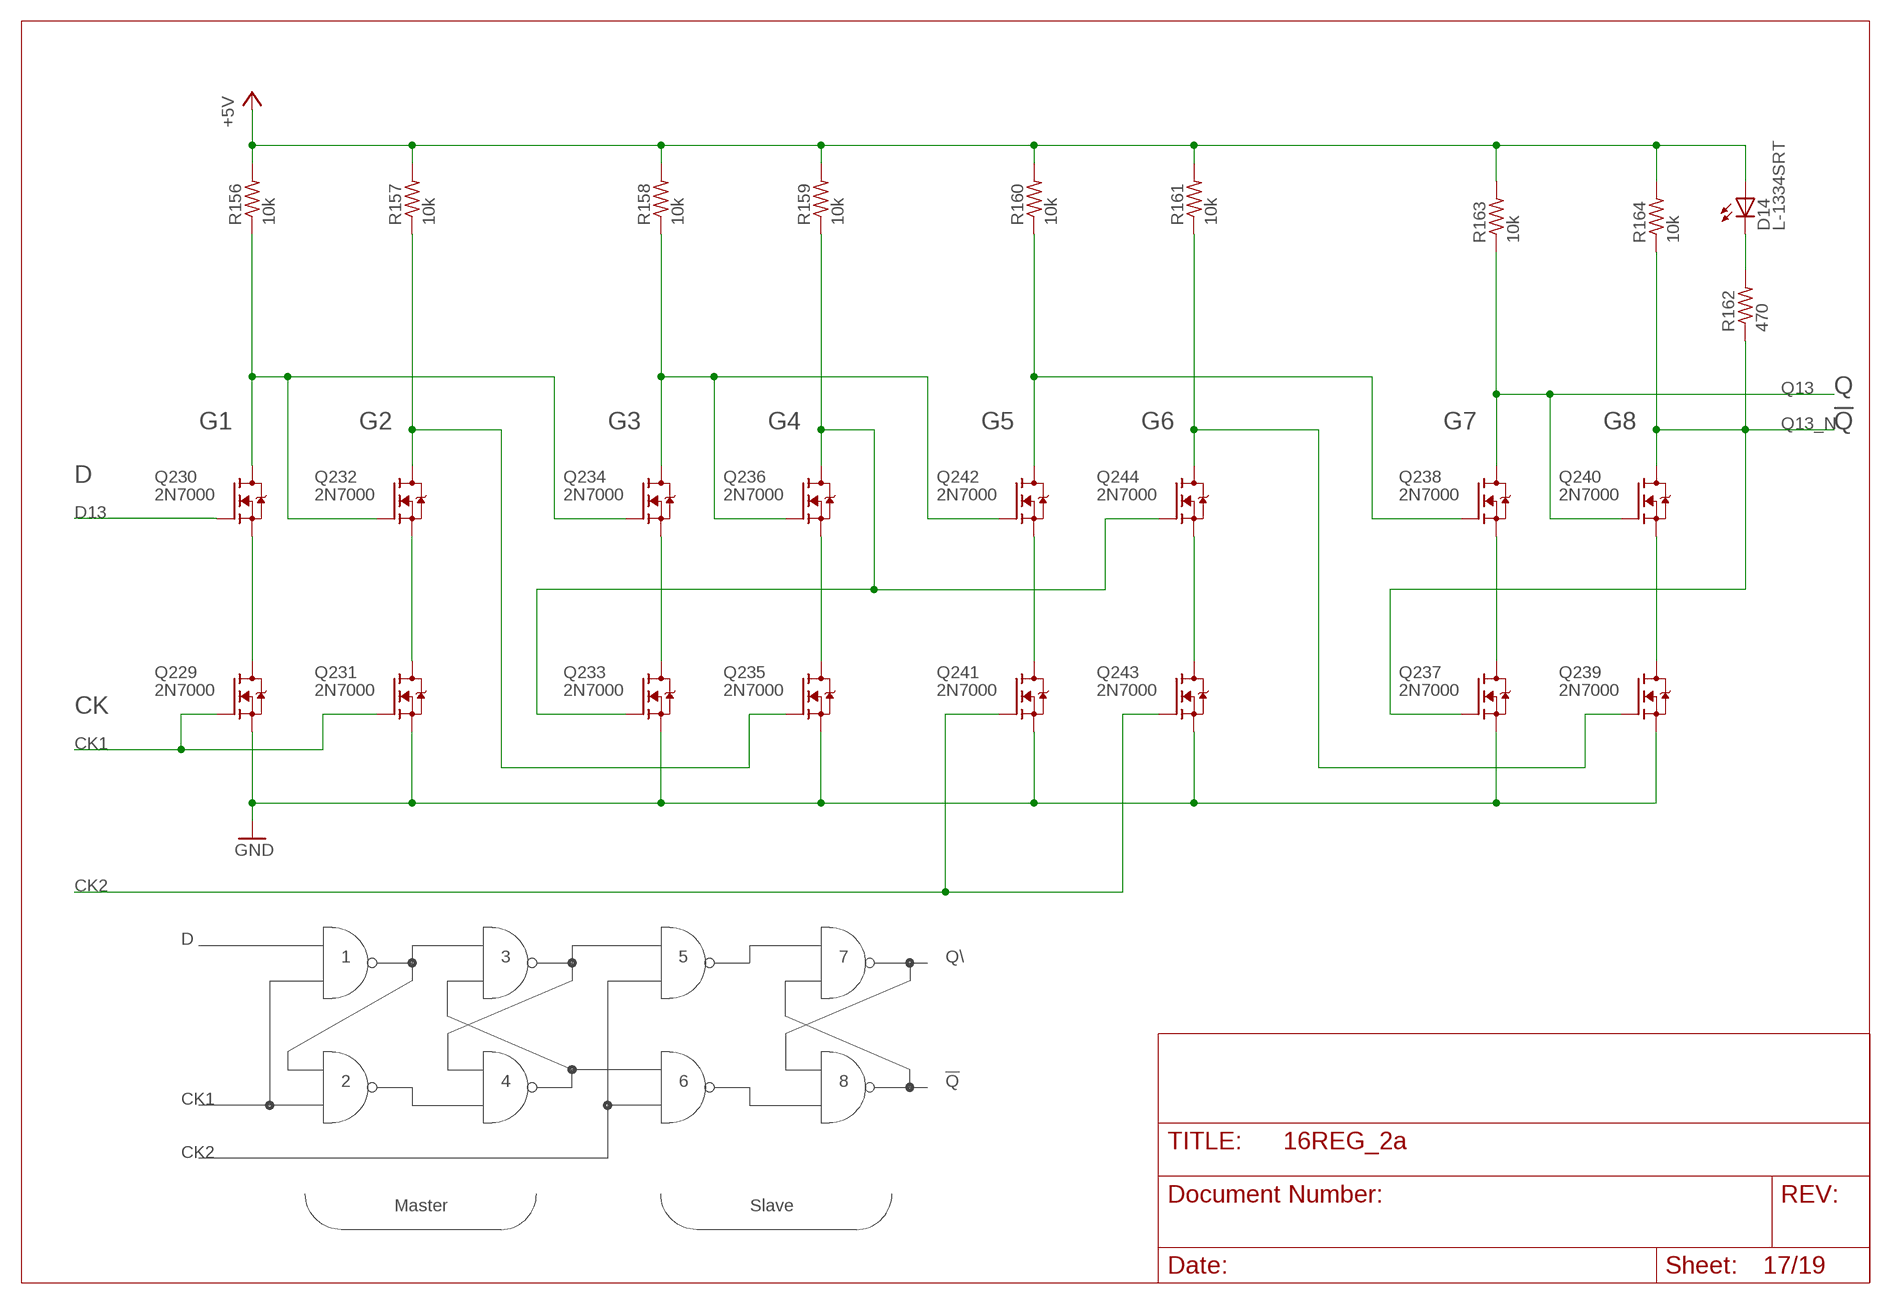
[diagram p16: schematic, sheet 17]

### Parts
D14  L-1334SRT  [LED3MM]
Q229  2N7000  [TO92-DGS]
Q230  2N7000  [TO92-DGS]
Q231  2N7000  [TO92-DGS]
Q232  2N7000  [TO92-DGS]
Q233  2N7000  [TO92-DGS]
Q234  2N7000  [TO92-DGS]
Q235  2N7000  [TO92-DGS]
Q236  2N7000  [TO92-DGS]
Q237  2N7000  [TO92-DGS]
Q238  2N7000  [TO92-DGS]
Q239  2N7000  [TO92-DGS]
Q240  2N7000  [TO92-DGS]
Q241  2N7000  [TO92-DGS]
Q242  2N7000  [TO92-DGS]
Q243  2N7000  [TO92-DGS]
Q244  2N7000  [TO92-DGS]
R156  10k  R_P2INCH  [R_P2INCH]
R157  10k  R_P2INCH  [R_P2INCH]
R158  10k  R_P2INCH  [R_P2INCH]
R159  10k  R_P2INCH  [R_P2INCH]
R160  10k  R_P2INCH  [R_P2INCH]
R161  10k  R_P2INCH  [R_P2INCH]
R162  470  R_P2INCH  [R_P2INCH]
R163  10k  R_P2INCH  [R_P2INCH]
R164  10k  R_P2INCH  [R_P2INCH]

### Nets
+5V: D14.A R156.2 R157.2 R158.2 R159.2 R160.2 R161.2 R163.2 R164.2 ; also sheet 1,3,4,5,6,7,8,9,10,11,12,13,14,15,16,18,19
CK1: Q229.G Q231.G ; also sheet 1,4,5,6,7,8,9,10,11,12,13,14,15,16,18,19
CK2: Q241.G Q243.G ; also sheet 1,4,5,6,7,8,9,10,11,12,13,14,15,16,18,19
D13: Q230.G ; also sheet 1,3
GND: Q229.S Q231.S Q233.S Q235.S Q237.S Q239.S Q241.S Q243.S ; also sheet 1,2,3,4,5,6,7,8,9,10,11,12,13,14,15,16,18,19
N$200: Q229.D Q230.S
N$204: Q231.D Q232.S
N$206: Q233.D Q234.S
N$208: Q235.D Q236.S
N$210: Q237.D Q238.S
N$212: Q239.D Q240.S
N$214: Q230.D Q232.G Q234.G R156.1
N$216: Q233.G Q236.D Q244.G R159.1
N$218: D14.K(C) R162.2
N$220: Q234.D Q236.G Q242.G R158.1
N$222: Q232.D Q235.G R157.1
N$224: Q241.D Q242.S
N$226: Q243.D Q244.S
N$228: Q238.G Q242.D R160.1
N$230: Q239.G Q244.D R161.1
Q13: Q238.D Q240.G R163.1 ; also sheet 1,2
Q13_N: Q237.G Q240.D R162.1 R164.1

### Notes on the sheet
- Q
- G1 | G2 | G3 | G4 | G5 | G6 | G7 | G8 | !Q
- D
- CK
- D
- 1 | 3 | 5 | 7 | Q\
- 2 | 4 | 6 | 8 | !Q
- CK1
- CK2
- Master | Slave

## Sheet 18 of 19
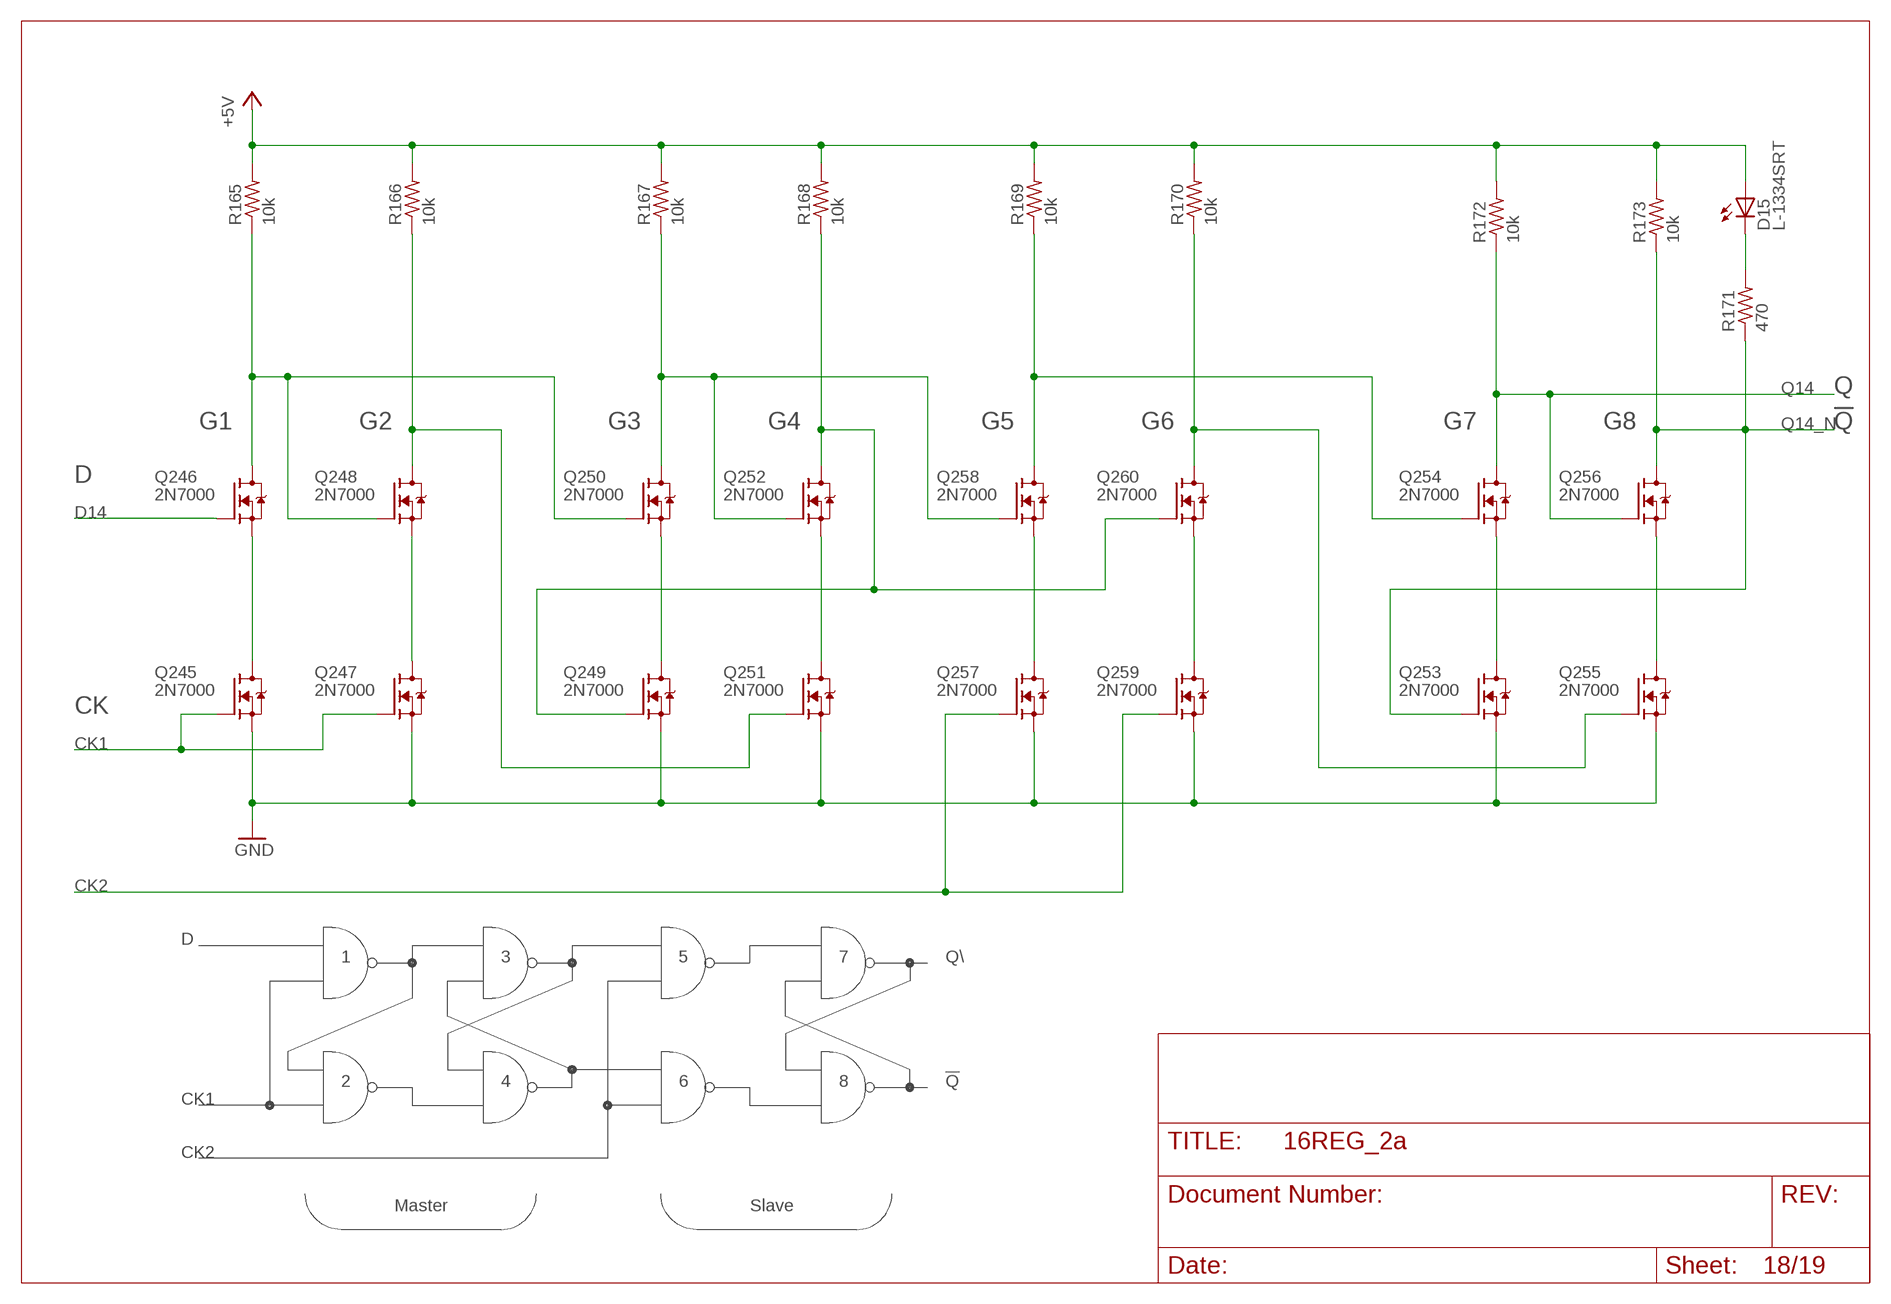
[diagram p17: schematic, sheet 18]

### Parts
D15  L-1334SRT  [LED3MM]
Q245  2N7000  [TO92-DGS]
Q246  2N7000  [TO92-DGS]
Q247  2N7000  [TO92-DGS]
Q248  2N7000  [TO92-DGS]
Q249  2N7000  [TO92-DGS]
Q250  2N7000  [TO92-DGS]
Q251  2N7000  [TO92-DGS]
Q252  2N7000  [TO92-DGS]
Q253  2N7000  [TO92-DGS]
Q254  2N7000  [TO92-DGS]
Q255  2N7000  [TO92-DGS]
Q256  2N7000  [TO92-DGS]
Q257  2N7000  [TO92-DGS]
Q258  2N7000  [TO92-DGS]
Q259  2N7000  [TO92-DGS]
Q260  2N7000  [TO92-DGS]
R165  10k  R_P2INCH  [R_P2INCH]
R166  10k  R_P2INCH  [R_P2INCH]
R167  10k  R_P2INCH  [R_P2INCH]
R168  10k  R_P2INCH  [R_P2INCH]
R169  10k  R_P2INCH  [R_P2INCH]
R170  10k  R_P2INCH  [R_P2INCH]
R171  470  R_P2INCH  [R_P2INCH]
R172  10k  R_P2INCH  [R_P2INCH]
R173  10k  R_P2INCH  [R_P2INCH]

### Nets
+5V: D15.A R165.2 R166.2 R167.2 R168.2 R169.2 R170.2 R172.2 R173.2 ; also sheet 1,3,4,5,6,7,8,9,10,11,12,13,14,15,16,17,19
CK1: Q245.G Q247.G ; also sheet 1,4,5,6,7,8,9,10,11,12,13,14,15,16,17,19
CK2: Q257.G Q259.G ; also sheet 1,4,5,6,7,8,9,10,11,12,13,14,15,16,17,19
D14: Q246.G ; also sheet 1,3
GND: Q245.S Q247.S Q249.S Q251.S Q253.S Q255.S Q257.S Q259.S ; also sheet 1,2,3,4,5,6,7,8,9,10,11,12,13,14,15,16,17,19
N$232: Q245.D Q246.S
N$234: Q247.D Q248.S
N$235: Q249.D Q250.S
N$236: Q251.D Q252.S
N$237: Q253.D Q254.S
N$238: Q255.D Q256.S
N$239: Q246.D Q248.G Q250.G R165.1
N$240: Q249.G Q252.D Q260.G R168.1
N$241: D15.K(C) R171.2
N$242: Q250.D Q252.G Q258.G R167.1
N$243: Q248.D Q251.G R166.1
N$244: Q257.D Q258.S
N$245: Q259.D Q260.S
N$246: Q254.G Q258.D R169.1
N$247: Q255.G Q260.D R170.1
Q14: Q254.D Q256.G R172.1 ; also sheet 1,2
Q14_N: Q253.G Q256.D R171.1 R173.1

### Notes on the sheet
- Q
- G1 | G2 | G3 | G4 | G5 | G6 | G7 | G8 | !Q
- D
- CK
- D
- 1 | 3 | 5 | 7 | Q\
- 2 | 4 | 6 | 8 | !Q
- CK1
- CK2
- Master | Slave

## Sheet 19 of 19
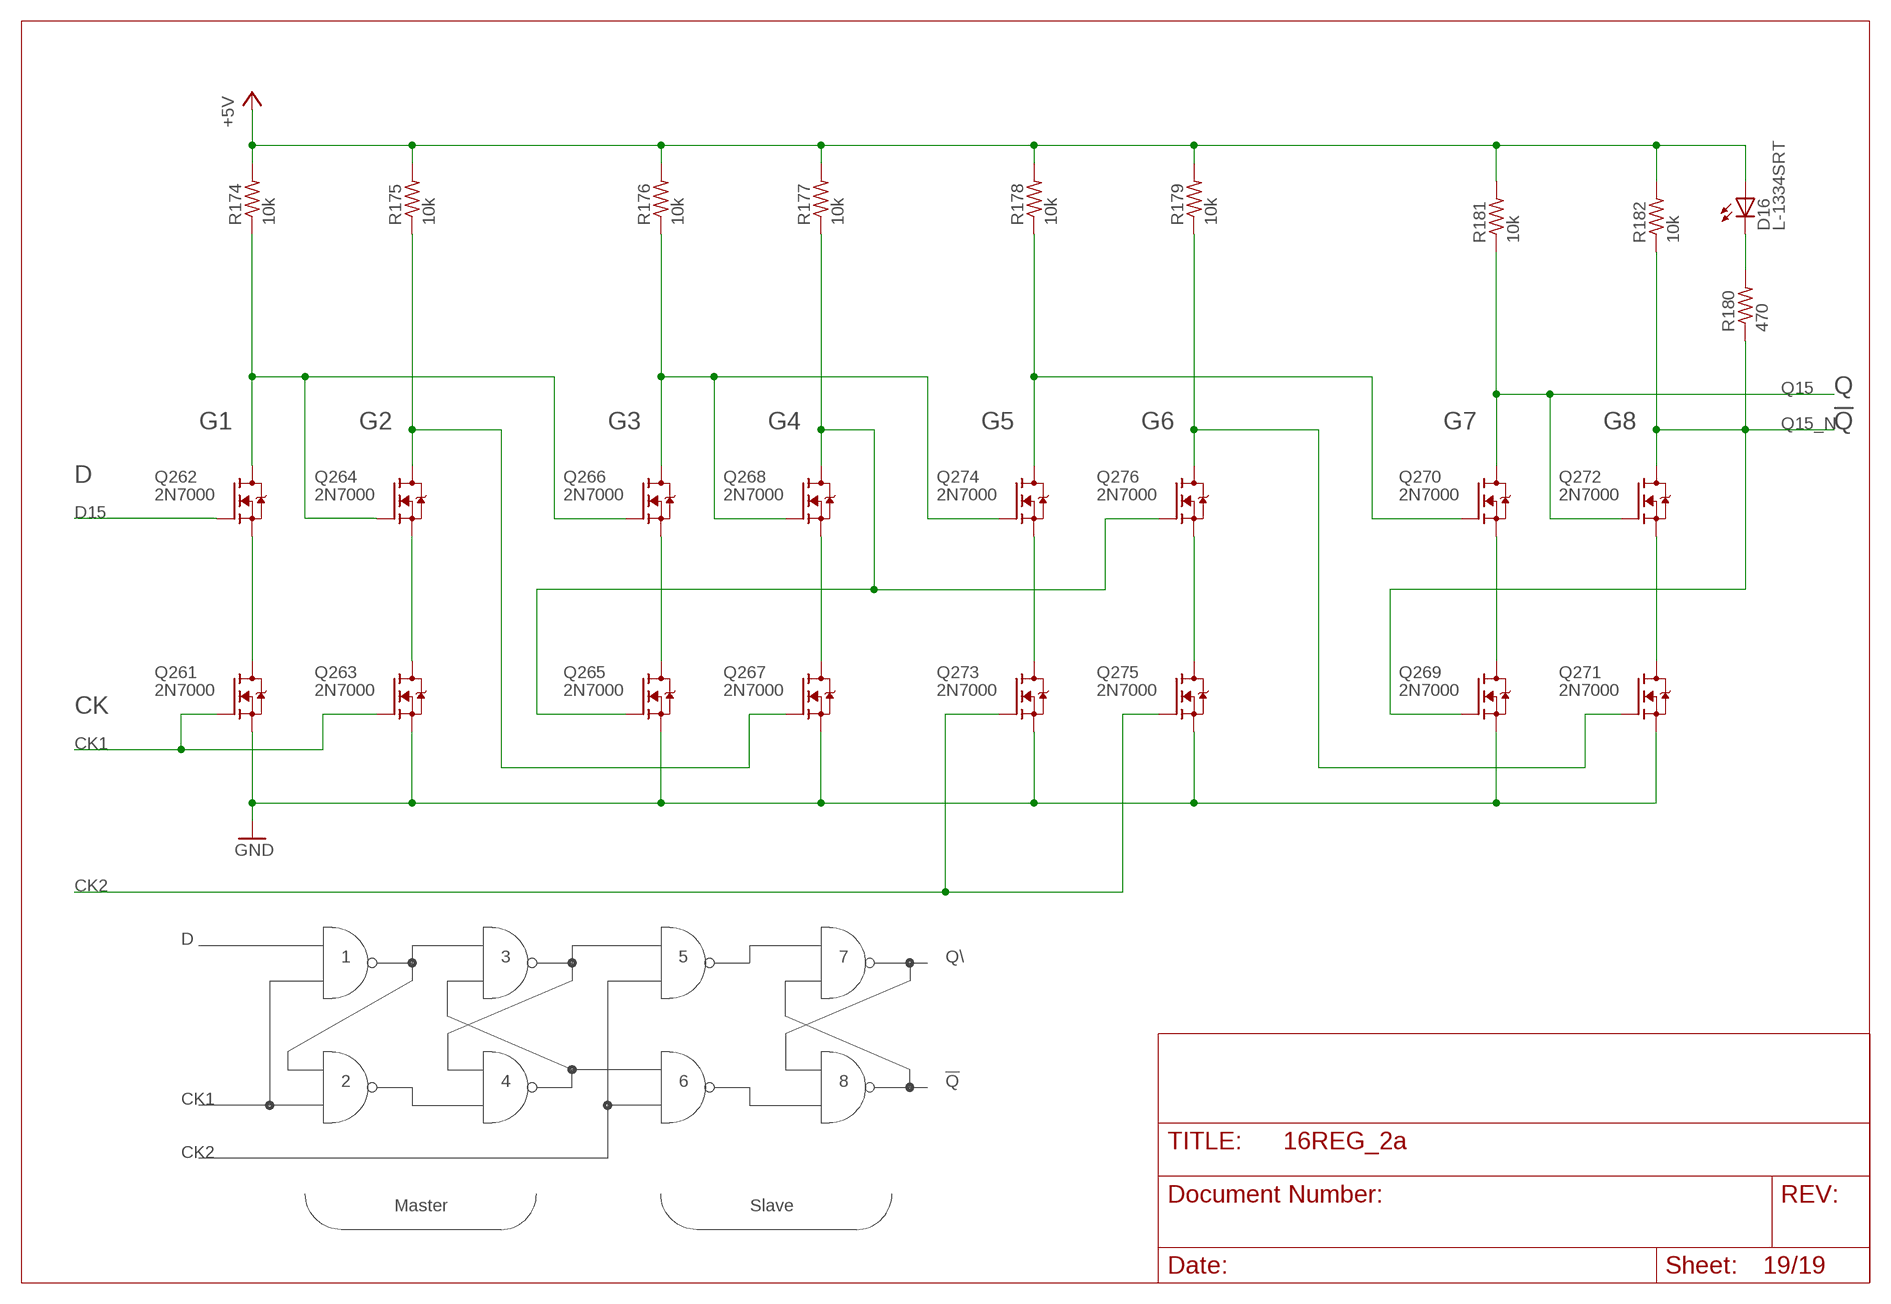
[diagram p18: schematic, sheet 19]

### Parts
D16  L-1334SRT  [LED3MM]
Q261  2N7000  [TO92-DGS]
Q262  2N7000  [TO92-DGS]
Q263  2N7000  [TO92-DGS]
Q264  2N7000  [TO92-DGS]
Q265  2N7000  [TO92-DGS]
Q266  2N7000  [TO92-DGS]
Q267  2N7000  [TO92-DGS]
Q268  2N7000  [TO92-DGS]
Q269  2N7000  [TO92-DGS]
Q270  2N7000  [TO92-DGS]
Q271  2N7000  [TO92-DGS]
Q272  2N7000  [TO92-DGS]
Q273  2N7000  [TO92-DGS]
Q274  2N7000  [TO92-DGS]
Q275  2N7000  [TO92-DGS]
Q276  2N7000  [TO92-DGS]
R174  10k  R_P2INCH  [R_P2INCH]
R175  10k  R_P2INCH  [R_P2INCH]
R176  10k  R_P2INCH  [R_P2INCH]
R177  10k  R_P2INCH  [R_P2INCH]
R178  10k  R_P2INCH  [R_P2INCH]
R179  10k  R_P2INCH  [R_P2INCH]
R180  470  R_P2INCH  [R_P2INCH]
R181  10k  R_P2INCH  [R_P2INCH]
R182  10k  R_P2INCH  [R_P2INCH]

### Nets
+5V: D16.A R174.2 R175.2 R176.2 R177.2 R178.2 R179.2 R181.2 R182.2 ; also sheet 1,3,4,5,6,7,8,9,10,11,12,13,14,15,16,17,18
CK1: Q261.G Q263.G ; also sheet 1,4,5,6,7,8,9,10,11,12,13,14,15,16,17,18
CK2: Q273.G Q275.G ; also sheet 1,4,5,6,7,8,9,10,11,12,13,14,15,16,17,18
D15: Q262.G ; also sheet 1,3
GND: Q261.S Q263.S Q265.S Q267.S Q269.S Q271.S Q273.S Q275.S ; also sheet 1,2,3,4,5,6,7,8,9,10,11,12,13,14,15,16,17,18
N$248: Q261.D Q262.S
N$249: Q263.D Q264.S
N$250: Q265.D Q266.S
N$251: Q267.D Q268.S
N$252: Q269.D Q270.S
N$253: Q271.D Q272.S
N$254: Q262.D Q264.G Q266.G R174.1
N$255: Q265.G Q268.D Q276.G R177.1
N$256: D16.K(C) R180.2
N$257: Q266.D Q268.G Q274.G R176.1
N$258: Q264.D Q267.G R175.1
N$259: Q273.D Q274.S
N$260: Q275.D Q276.S
N$261: Q270.G Q274.D R178.1
N$262: Q271.G Q276.D R179.1
Q15: Q270.D Q272.G R181.1 ; also sheet 1,2
Q15_N: Q269.G Q272.D R180.1 R182.1

### Notes on the sheet
- Q
- G1 | G2 | G3 | G4 | G5 | G6 | G7 | G8 | !Q
- D
- CK
- D
- 1 | 3 | 5 | 7 | Q\
- 2 | 4 | 6 | 8 | !Q
- CK1
- CK2
- Master | Slave

## Library data of the parts
C1-C4 C6-C8 = MyLib:C_P2INCH
C5 = MyLib:POLARISED_CAP_2P5
D1-D34 = MyLib:L-1334SRT
HOLE1-HOLE4 = MyLib:3M_MOUNT_HOLE
J1 J2 = MyLib:20_HDR_LOCKING_RA
J3 = MyLib:30_HDR_LOCKING_RA
PP1 PP2 = MyLib:POWER_PAD
Q1-Q276 = MyLib:2N7000
R1-R9 R26-R182 = MyLib:R_P2INCH
TP1 TP2 = MyLib:TEST_LOOP